# EAGLE design noise_monitor (EAGLE 9.6.2)

## Sheet 1 of 2
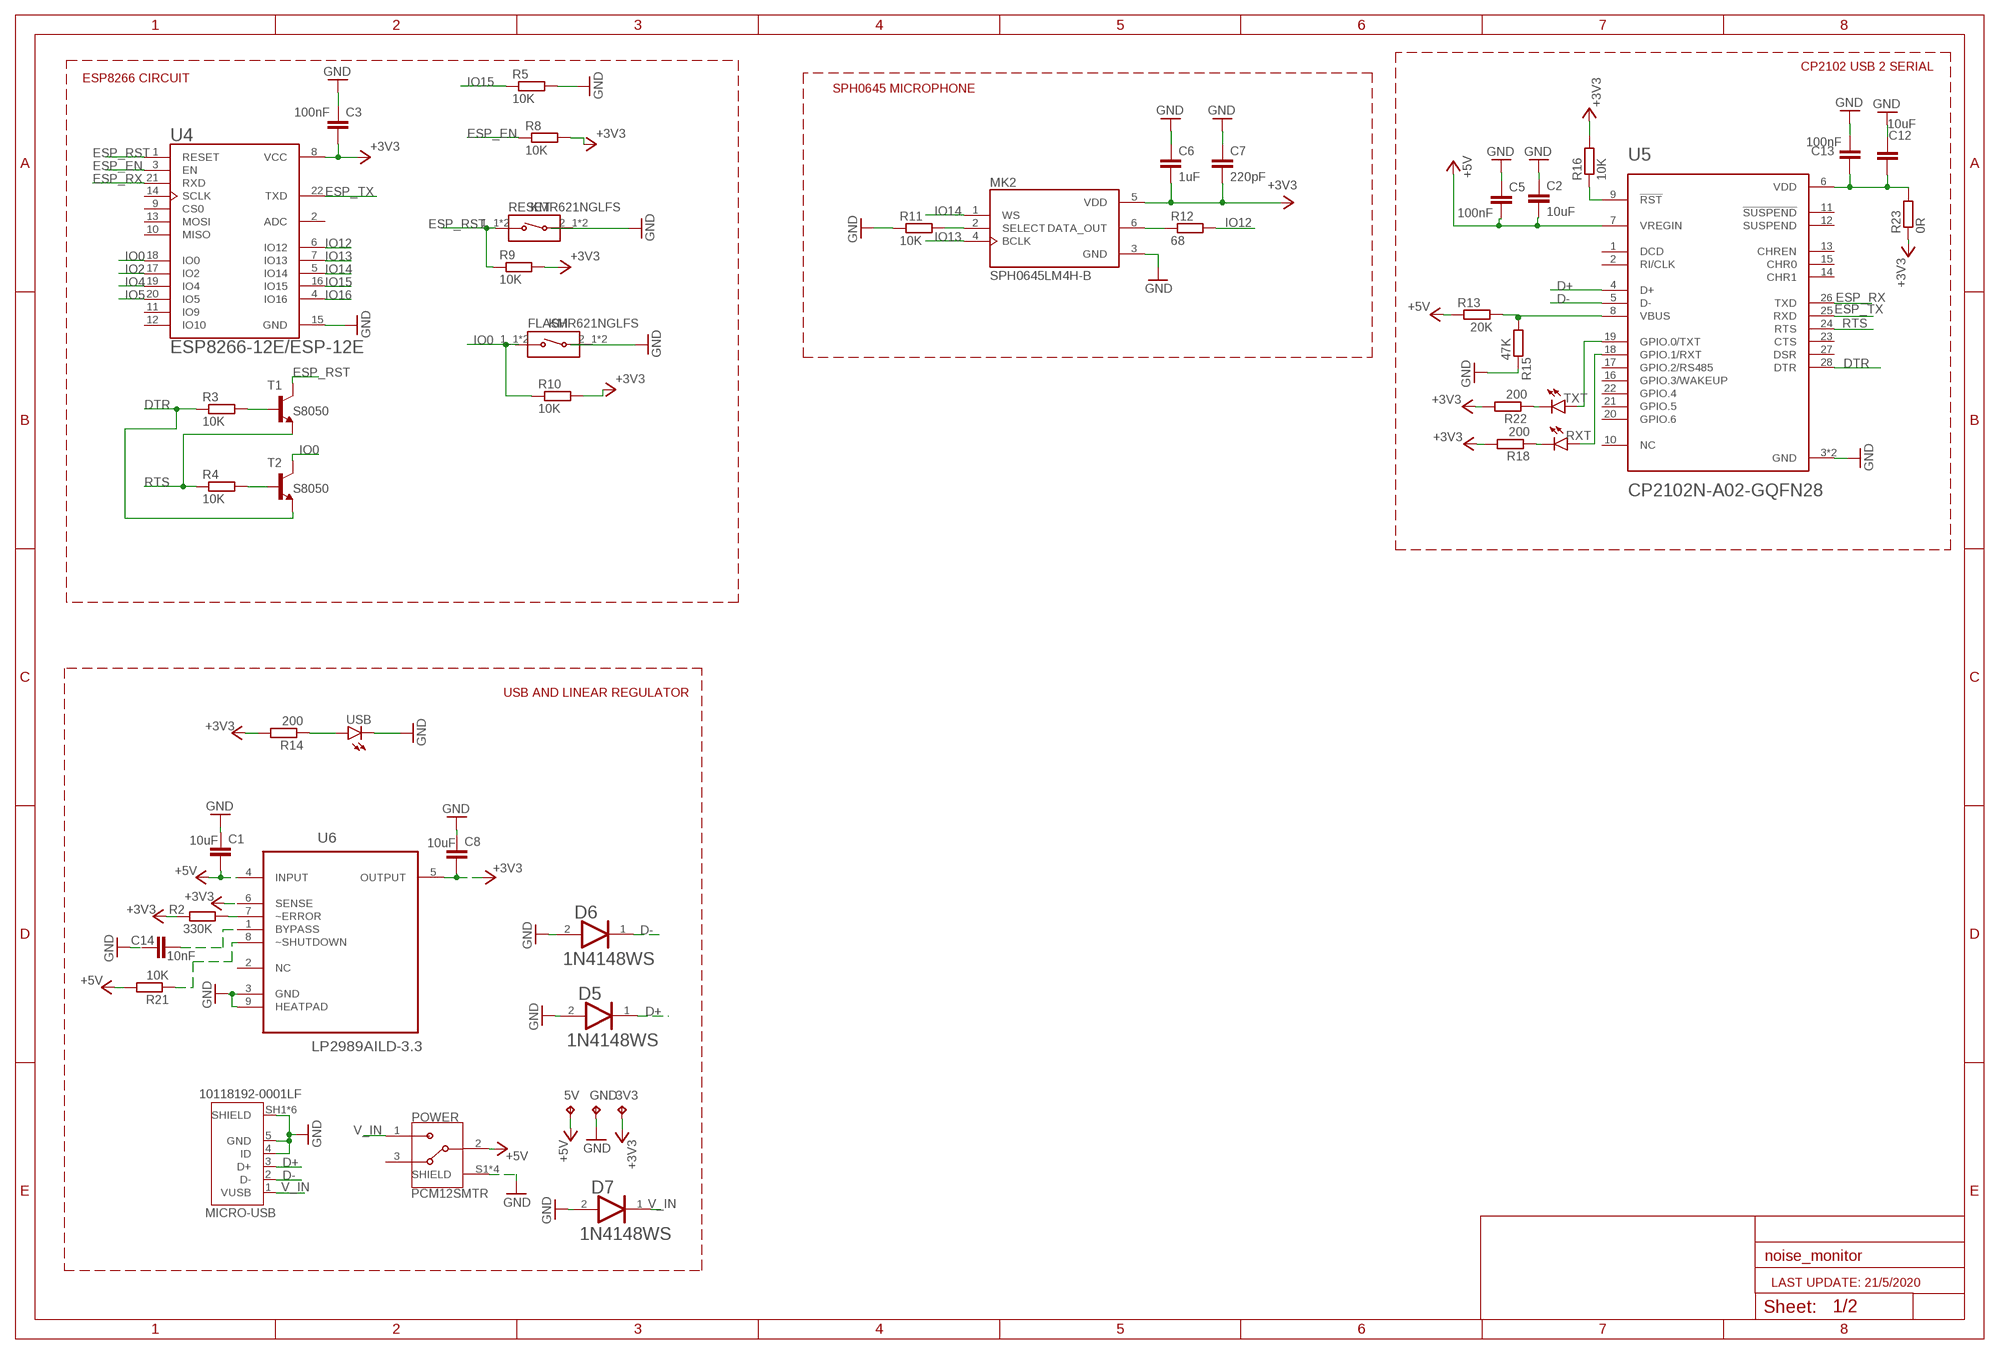
[diagram p0: schematic, sheet 1]

### Parts
3V3  TPTP06R  [TP06R]
5V  TPTP06R  [TP06R]
C1  10uF  C-EUC0603  [C0603]
C2  10uF  C-EUC0603  [C0603]
C3  100nF  C-EUC0805  [C0805]
C5  100nF  C-EUC0805  [C0805]
C6  1uF  C-EUC0603  [C0603]
C7  220pF  C-EUC0603  [C0603]
C8  10uF  C-EUC0603  [C0603]
C12  10uF  C-EUC0603  [C0603]
C13  100nF  C-EUC0805  [C0805]
C14  10nF  C-EUC0603  [C0603]
D5  ON_SEMI_1N4148WSON_SEMI_1N4148WS_0_0  [ON_SEMI_1N4148WS_0]
D6  ON_SEMI_1N4148WSON_SEMI_1N4148WS_0_0  [ON_SEMI_1N4148WS_0]
D7  ON_SEMI_1N4148WSON_SEMI_1N4148WS_0_0  [ON_SEMI_1N4148WS_0]
FLASH  KMR621NGLFS  [SW_KMR621NGLFS]
GND  TPTP06R  [TP06R]
MICRO-USB  10118192-0001LF  [AMPHENOL_10118192-0001LF]
MK2  SPH0645LM4H-B  [MIC_SPH0645LM4H-B]
POWER  PCM12SMTR  [SW_PCM12SMTR]
R2  330K  R-EU_R0603  [R0603]
R3  10K  R-EU_R0603  [R0603]
R4  10K  R-EU_R0603  [R0603]
R5  10K  R-EU_R0603  [R0603]
R8  10K  R-EU_R0603  [R0603]
R9  10K  R-EU_R0603  [R0603]
R10  10K  R-EU_R0603  [R0603]
R11  10K  R-EU_R0603  [R0603]
R12  68  R-EU_R0603  [R0603]
R13  20K  R-EU_R0603  [R0603]
R14  200  R-EU_R0603  [R0603]
R15  47K  R-EU_R0603  [R0603]
R16  10K  R-EU_R0603  [R0603]
R18  200  R-EU_R0603  [R0603]
R21  10K  R-EU_R0603  [R0603]
R22  200  R-EU_R0603  [R0603]
R23  0R  R-EU_R0201  [R0201]
RESET  KMR621NGLFS  [SW_KMR621NGLFS]
RXT  LEDCHIP-LED0603  [CHIP-LED0603]
T1  S8050  MMUN2214LT1-NPN-SC59-BEC  [SC59-BEC]
T2  S8050  MMUN2214LT1-NPN-SC59-BEC  [SC59-BEC]
TXT  LEDCHIP-LED0603  [CHIP-LED0603]
U4  ESP8266-12E/ESP-12E  [XCVR_ESP8266-12E/ESP-12E]
U5  CP2102N-A02-GQFN28  [QFN50P500X500X80-29N]
U6  LP2989AILD-3.3  [DFN400X400X80-9N]
USB  LEDCHIP-LED0603  [CHIP-LED0603]

### Nets
+3V3 [POWER]: 3V3.TP C3.2 C6.2 C7.2 C8.2 MK2.5(VDD) R2.1 R8.2 R9.2 R10.2 R14.2 R16.2 R18.2 R22.2 R23.1 U4.8(VCC) U6.5(OUTPUT) U6.6(SENSE) ; also sheet 2
+5V [POWER]: 5V.TP C1.2 C2.2 C5.2 POWER.2 R13.1 R21.2 U5.7(VREGIN) U6.4(INPUT) ; also sheet 2
D+: D5.1(CATHODE) MICRO-USB.3(D+) U5.4(D+)
D-: D6.1(CATHODE) MICRO-USB.2(D-) U5.5(D-)
DTR: R3.1 T2.E U5.28(DTR)
ESP_EN: R8.1 U4.3(EN)
ESP_RST: R9.1 RESET.1_1 RESET.1_2 T1.C U4.1(RESET)
ESP_RX: U4.21(RXD) U5.26(TXD)
ESP_TX: U4.22(TXD) U5.25(RXD)
GND: C1.1 C2.1 C3.1 C5.1 C6.1 C7.1 C8.1 C12.1 C13.1 C14.1 D5.2(ANODE) D6.2(ANODE) D7.2(ANODE) FLASH.2_1 FLASH.2_2 GND.TP MICRO-USB.4(ID) MICRO-USB.5(GND) MICRO-USB.SH1(SHIELD) MICRO-USB.SH2(SHIELD) MICRO-USB.SH3(SHIELD) MICRO-USB.SH4(SHIELD) MICRO-USB.SH5(SHIELD) MICRO-USB.SH6(SHIELD) MK2.3(GND) POWER.S1(SHIELD) POWER.S2(SHIELD) POWER.S3(SHIELD) POWER.S4(SHIELD) R5.2 R11.1 R15.2 RESET.2_1 RESET.2_2 U4.15(GND) U5.3(GND) U5.29(GND) U6.3(GND) U6.9(HEATPAD) USB.C ; also sheet 2
IO0: FLASH.1_1 FLASH.1_2 R10.1 T2.C U4.18(IO0) ; also sheet 2
IO2: U4.17(IO2) ; also sheet 2
IO4: U4.19(IO4)
IO5: U4.20(IO5)
IO12: R12.2 U4.6(IO12)
IO13: MK2.4(BCLK) U4.7(IO13)
IO14: MK2.1(WS) U4.5(IO14)
IO15: R5.1 U4.16(IO15)
IO16: U4.4(IO16)
N$1 [POWER]: C12.2 C13.2 R23.2 U5.6(VDD)
N$2: R2.2 U6.7(~ERROR)
N$3: MK2.2(SELECT) R11.2
N$4: R13.2 R15.1 U5.8(VBUS)
N$5: R16.1 U5.9(!RST)
N$7: R22.1 TXT.C
N$8: R18.1 RXT.C
N$15: R3.2 T1.B
N$16: R4.2 T2.B
N$17: TXT.A U5.19(GPIO.0/TXT)
N$18: RXT.A U5.18(GPIO.1/RXT)
N$20: C14.2 U6.1(BYPASS)
N$21: R21.1 U6.8(~SHUTDOWN)
N$22: MK2.6(DATA_OUT) R12.1
N$25: R14.1 USB.A
RTS: R4.1 T1.E U5.24(RTS)
V_IN: D7.1(CATHODE) MICRO-USB.1(VUSB) POWER.1
Unconnected: POWER.3 U4.2(ADC) U4.9(CS0) U4.10(MISO) U4.11(IO9) U4.12(IO10) U4.13(MOSI) U4.14(SCLK) U5.1(DCD) U5.2(RI/CLK) U5.10(NC) U5.11(!SUSPEND) U5.12(SUSPEND) U5.13(CHREN) U5.14(CHR1) U5.15(CHR0) U5.16(GPIO.3/WAKEUP) U5.17(GPIO.2/RS485) U5.20(GPIO.6) U5.21(GPIO.5) U5.22(GPIO.4) U5.23(CTS) U5.27(DSR) U6.2(NC)

### Notes on the sheet
- CP2102 USB 2 SERIAL
- ESP8266 CIRCUIT
- SPH0645 MICROPHONE
- USB AND LINEAR REGULATOR
- LAST UPDATE: 21/5/2020

## Sheet 2 of 2
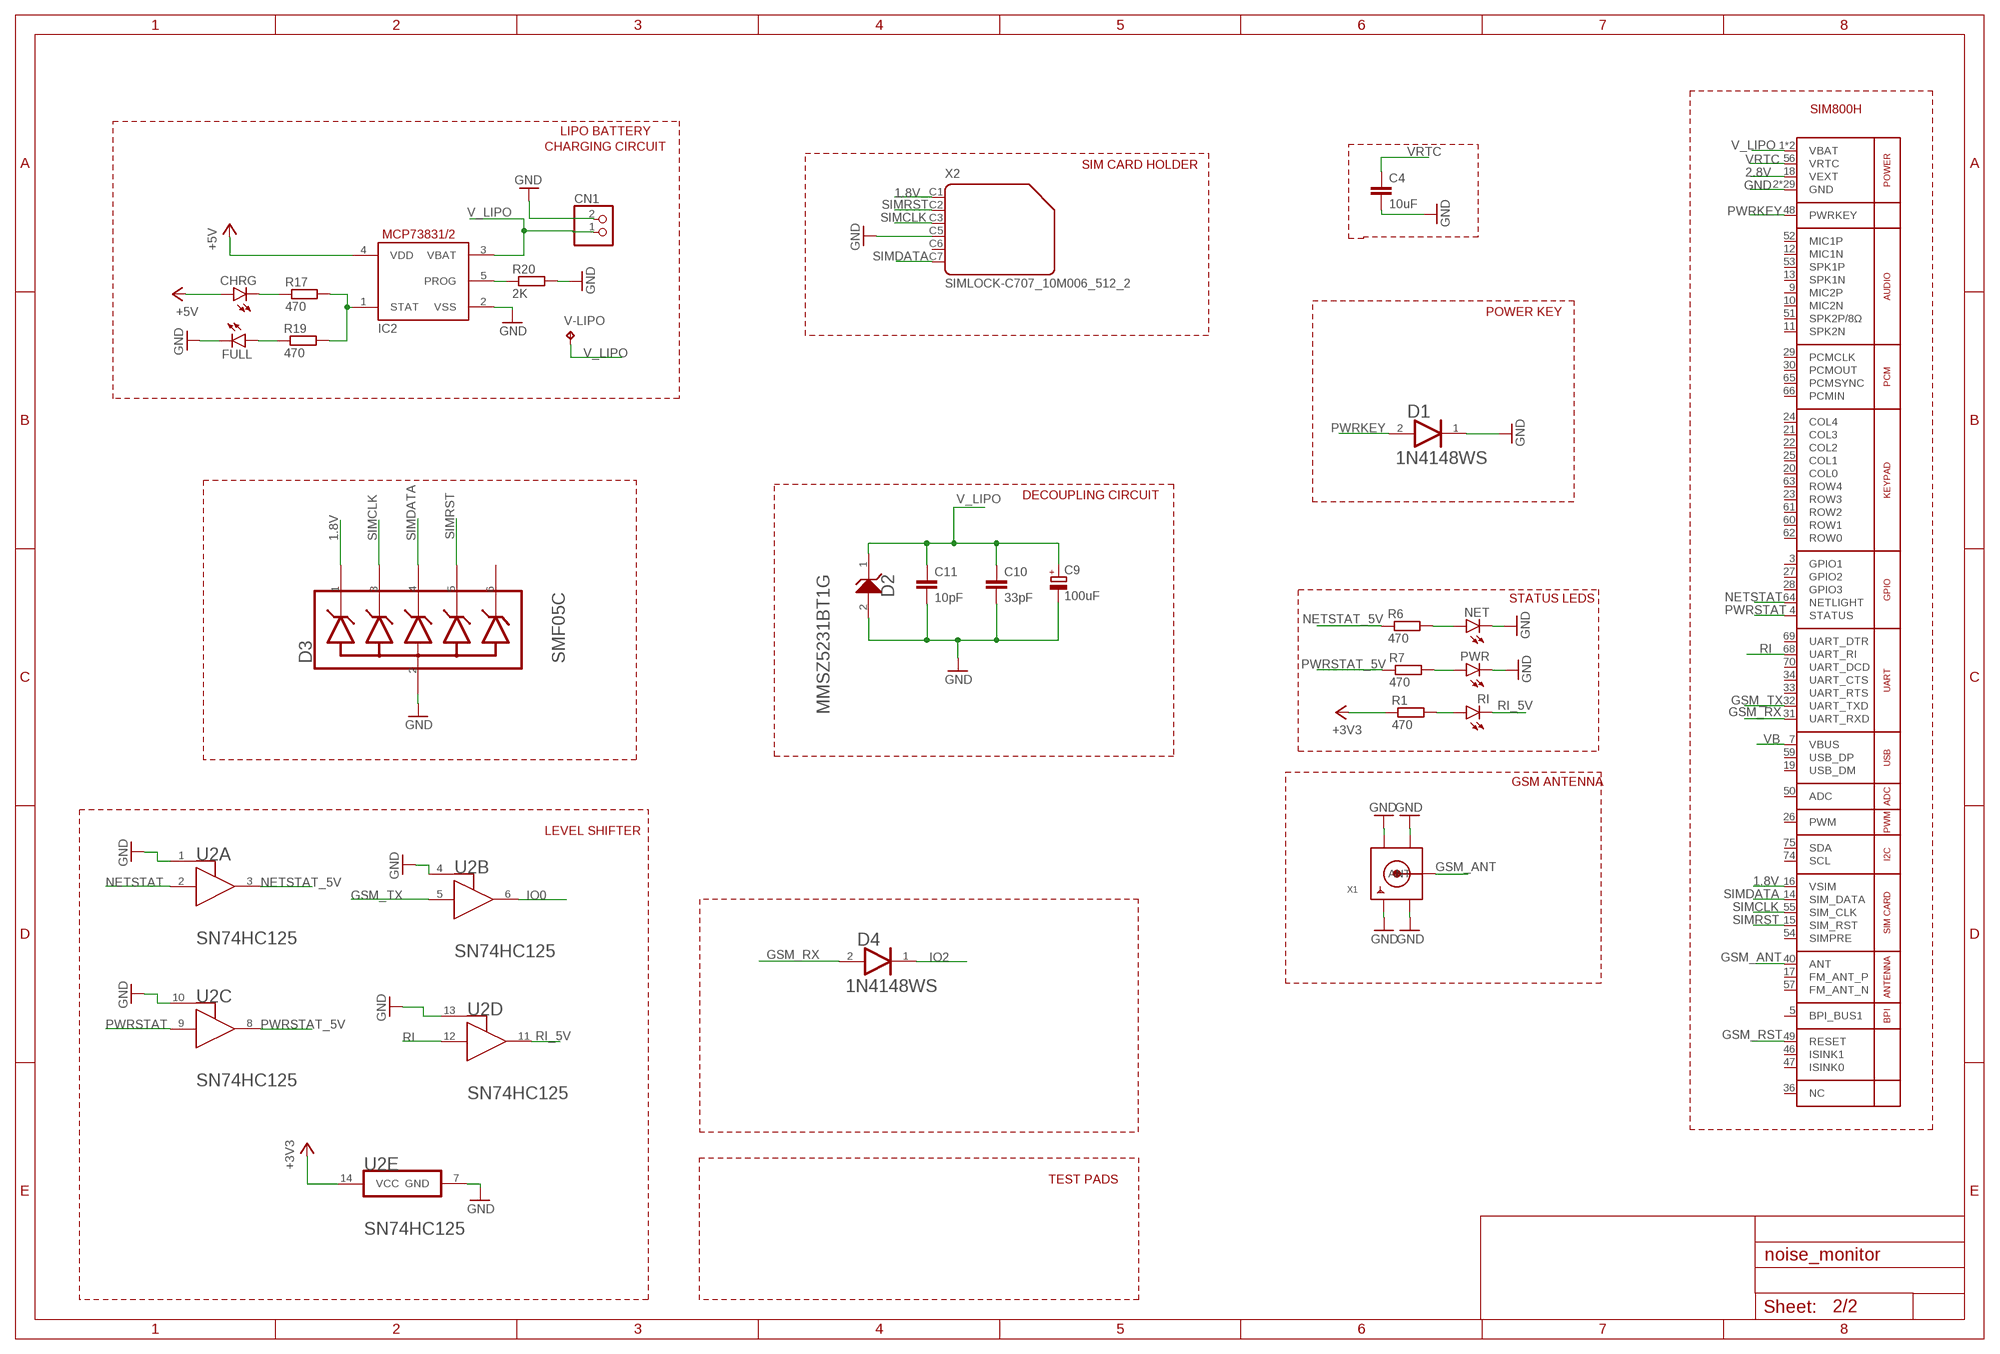
[diagram p1: schematic, sheet 2]

### Parts
C4  10uF  C-EUC0603  [C0603]
C9  100uF  CPOL-EUD  [PANASONIC_D]
C10  33pF  C-EUC0603  [C0603]
C11  10pF  C-EUC0603  [C0603]
CHRG  LEDCHIP-LED0603  [CHIP-LED0603]
CN1  JST_2PIN-SMT-RA  [JST-PH-2-SMT-RA]
D1  ON_SEMI_1N4148WSON_SEMI_1N4148WS_0_0  [ON_SEMI_1N4148WS_0]
D2  ON_SEMICONDUCTOR_MMSZ5231BT1GON_SEMICONDUCTOR_MMSZ5231BT1G_0_0  [ON_SEMICONDUCTOR_MMSZ5231BT1G_0]
D3  SEMTECH_SMF05CSEMTECH_SMF05C_0_0  [SEMTECH_SMF05C_0]
D4  ON_SEMI_1N4148WSON_SEMI_1N4148WS_0_0  [ON_SEMI_1N4148WS_0]
FULL  LEDCHIP-LED0603  [CHIP-LED0603]
IC2  MCP73831/OT  [SOT23-5L]
NET  LEDCHIP-LED0603  [CHIP-LED0603]
PWR  LEDCHIP-LED0603  [CHIP-LED0603]
R1  470  R-EU_R0603  [R0603]
R6  470  R-EU_R0603  [R0603]
R7  470  R-EU_R0603  [R0603]
R17  470  R-EU_R0603  [R0603]
R19  470  R-EU_R0603  [R0603]
R20  2K  R-EU_R0603  [R0603]
RI  LEDCHIP-LED0603  [CHIP-LED0603]
U1  GSM_SIM800L  [SIM800L]
U2  TEXAS_INSTRUMENTS_SN74HC125TEXAS_INSTRUMENTS_SN74HC125_0_0  [TEXAS_INSTRUMENTS_SN74HC125_0]
V-LIPO  TPTP06R  [TP06R]
X1  SMACONNECTOR_EDGE_UFL  [SMA_EDGELAUNCH_UFL]
X2  SIMLOCK-C707_10M006_512_2  [C707_10M006_512_2]

### Nets
1.8V: D3.1(1_CATHODE) U1.16(VSIM) X2.C1
2.8V: U1.18(VEXT)
+3V3 [POWER]: R1.1 U2.14(E:VCC) ; also sheet 1
+5V [POWER]: CHRG.A IC2.4(VDD) ; also sheet 1
GND: C4.2 C9.- C10.2 C11.2 CN1.2 D1.1(CATHODE) D2.2(A) D3.2(ANODE) FULL.C IC2.2(VSS) NET.C PWR.C R20.2 U1.2(GND) U1.6(GND) U1.8(GND) U1.35(GND) U1.37(GND) U1.38(GND) U1.39(GND) U1.41(GND) U1.43(GND) U1.44(GND) U1.45(GND) U1.58(GND) U1.67(GND) U1.71(GND) U1.72(GND) U1.73(GND) U1.76(GND) U1.77(GND) U1.78(GND) U1.79(GND) U1.80(GND) U1.81(GND) U1.82(GND) U1.83(GND) U1.84(GND) U1.85(GND) U1.86(GND) U1.87(GND) U1.88(GND) U2.1(A:1_!OE!) U2.4(B:4_!OE!) U2.7(E:GND) U2.10(C:2_!OE!) U2.13(D:3_!OE!) X1.GND@1(GND1) X1.GND@2(GND2) X1.GND@3(GND3) X1.GND@4(GND4) X2.C5 ; also sheet 1
GSM_ANT: U1.40(ANT) X1.P(ANT)
GSM_RST [BGA]: U1.49(RESET)
GSM_RX: D4.2(ANODE) U1.31(UART_RXD)
GSM_TX: U1.32(UART_TXD) U2.5(B:2A)
IO0: U2.6(B:2Y) ; also sheet 1
IO2: D4.1(CATHODE) ; also sheet 1
N$6: CHRG.C R17.1
N$9: IC2.1(STAT) R17.2 R19.2
N$10: NET.A R6.2
N$11: PWR.A R7.2
N$12: FULL.A R19.1
N$13: IC2.5(PROG) R20.1
N$14: R1.2 RI.A
NETSTAT [BGA]: U1.64(NETLIGHT) U2.2(A:1A)
NETSTAT_5V: R6.1 U2.3(A:1Y)
PWRKEY [BGA]: D1.2(ANODE) U1.48(PWRKEY)
PWRSTAT: U1.4(STATUS) U2.9(C:3A)
PWRSTAT_5V: R7.1 U2.8(C:3Y)
RI [BGA]: U1.68(UART_RI) U2.12(D:4A)
RI_5V: RI.C U2.11(D:4Y)
SIMCLK [BGA]: D3.3(2_CATHODE) U1.55(SIM_CLK) X2.C3
SIMDATA: D3.4(3_CATHODE) U1.14(SIM_DATA) X2.C7
SIMRST: D3.5(4_CATHODE) U1.15(SIM_RST) X2.C2
V_LIPO: C9.+ C10.1 C11.1 CN1.1 D2.1(K) IC2.3(VBAT) U1.1(VBAT) U1.42(VBAT) V-LIPO.TP
VB: U1.7(VBUS)
VRTC [BGA]: C4.1 U1.56(VRTC)
Unconnected: D3.6(5_CATHODE) U1.3(GPIO1) U1.5(BPI_BUS1) U1.9(MIC2P) U1.10(MIC2N) U1.11(SPK2N) U1.12(MIC1N) U1.13(SPK1N) U1.17(FM_ANT_P) U1.19(USB_DM) U1.20(COL0) U1.21(COL3) U1.22(COL2) U1.23(ROW3) U1.24(COL4) U1.25(COL1) U1.26(PWM) U1.27(GPIO2) U1.28(GPIO3) U1.29(PCMCLK) U1.30(PCMOUT) U1.33(UART_RTS) U1.34(UART_CTS) U1.36(NC) U1.46(ISINK1) U1.47(ISINK0) U1.50(ADC) U1.51(SPK2P/8Ω) U1.52(MIC1P) U1.53(SPK1P) U1.54(SIMPRE) U1.57(FM_ANT_N) U1.59(USB_DP) U1.60(ROW1) U1.61(ROW2) U1.62(ROW0) U1.63(ROW4) U1.65(PCMSYNC) U1.66(PCMIN) U1.69(UART_DTR) U1.70(UART_DCD) U1.74(SCL) U1.75(SDA) X2.C6

### Notes on the sheet
- SIM800H
- LIPO BATTERY
- CHARGING CIRCUIT
- SIM CARD HOLDER
- POWER KEY
- DECOUPLING CIRCUIT
- STATUS LEDS
- GSM ANTENNA
- LEVEL SHIFTER
- TEST PADS

## Library data of the parts
3V3 5V GND V-LIPO = testpad:TP: Test pad
C1-C8 C10-C14 = rcl:C-EU: CAPACITOR, European symbol; SPICEPREFIX: C
C9 = rcl:CPOL-EU: POLARIZED CAPACITOR, European symbol; SPICEPREFIX: C
CHRG FULL NET PWR RI RXT TXT USB = led:LED: LED OSRAM: - CHIPLED LG R971, LG N971, LY N971, LG Q971, LY Q971, LO R971, LY R971 LH N974, LH R974 LS Q976, LO Q976, LY Q976 LO Q996 - Hyper CHIPLED LW Q18S LB Q993, LB Q99A, LB R99A - SideLED LS A670, LO A670, LY A670, LG A670, LP A670 LB A673, LV A673, LT A673, LW A673 LH A674 LY A675 LS A676, LA A676, LO A676, LY A676, LW A676 LS A679, LY A679, LG A679 - Hyper Micro SIDELED® LS Y876, LA Y876, LO Y876, LY Y876 LT Y87S - SmartLED LW L88C, LW L88S LB L89C, LB L89S, LG L890 LS L89K, LO L89K, LY L89K LS L896, LA L896, LO L896, LY L896 - TOPLED LS T670, LO T670, LY T670, LG T670, LP T670 LSG T670, LSP T670, LSY T670, LOP T670, LYG T670 LG T671, LOG T671, LSG T671 LB T673, LV T673, LT T673, LW T673 LH T674 LS T676, LA T676, LO T676, LY T676, LB T676, LH T676, LSB T676, LW T676 LB T67C, LV T67C, LT T67C, LS T67K, LO T67K, LY T67K, LW E67C LS E67B, LA E67B, LO E67B, LY E67B, LB E67C, LV E67C, LT E67C LW T67C LS T679, LY T679, LG T679 LS T770, LO T770, LY T770, LG T770, LP T770 LB T773, LV T773, LT T773, LW T773 LH T774 LS E675, LA E675, LY E675, LS T675 LS T776, LA T776, LO T776, LY T776, LB T776 LHGB T686 LT T68C, LB T68C - Hyper Mini TOPLED® LB M676 - Mini TOPLED Santana® LG M470 LS M47K, LO M47K, LY M47K Source: http://www.osram.convergy.de LUXEON: - LUMILED® LXK2-PW12-R00, LXK2-PW12-S00, LXK2-PW14-U00, LXK2-PW14-V00 LXK2-PM12-R00, LXK2-PM12-S00, LXK2-PM14-U00 LXK2-PE12-Q00, LXK2-PE12-R00, LXK2-PE12-S00, LXK2-PE14-T00, LXK2-PE14-U00 LXK2-PB12-K00, LXK2-PB12-L00, LXK2-PB12-M00, LXK2-PB14-N00, LXK2-PB14-P00, LXK2-PB14-Q00 LXK2-PR12-L00, LXK2-PR12-M00, LXK2-PR14-Q00, LXK2-PR14-R00 LXK2-PD12-Q00, LXK2-PD12-R00, LXK2-PD12-S00 LXK2-PH12-R00, LXK2-PH12-S00 LXK2-PL12-P00, LXK2-PL12-Q00, LXK2-PL12-R00 Source: www.luxeon.com KINGBRIGHT: KA-3528ASYC Source: www.kingbright.com
CN1 = noise_monitor:JST_2PIN: JST 2-Pin Connectors of various flavors SMT-RA (S2B-PH-SM4) 4UConnector #17311 SMT (B2B-PH-SM4) THM-RA (S2B-PH) THM (B2B-PH)
D1 D4-D7 = noise_monitor:ON_SEMI_1N4148WS: Small Signal Diodes; CENTROID_NOT_SPECIFIED: No; DATASHEET: https://www.fairchildsemi.com/datasheets/1N/1N4148WS.pdf; DIGIKEY_DESCRIPTION: DIODE GEN PURP 75V 150MA SOD323F; DIGIKEY_PART_NUMBER: 1N4148WSFSCT-ND; IPC_LAND_PATTERN_NAME: SOD250125X70-2; LEAD_FREE: yes; MF: ON Semi; MFG_PACKAGE_IDENT: CASE 477AB; MOUSER_DESCRIPTION: Diodes - General Purpose, Power, Switching Small Signal Diode; MOUSER_PART_NUMBER: 512-1N4148WS; MPN: 1N4148WS; PACKAGE: SOD-323FL; PREFIX: D; ROHS: yes; TEMPERATURE_RANGE_HIGH: +150°C
D2 = noise_monitor:ON_SEMICONDUCTOR_MMSZ5231BT1G: ONSC-K1A2-2; CIIVA_IDS: 804101; COMPONENT_LINK_1_DESCRIPTION: Manufacturer URL; COMPONENT_LINK_1_URL: http://www.onsemi.com/; COMPONENT_LINK_3_DESCRIPTION: Package Specification; COMPONENT_LINK_3_URL: http://www.onsemi.com/pub_link/Collateral/425-04.PDF; DATASHEET: http://www.onsemi.com/pub_link/Collateral/MMSZ5221BT1-D.PDF; DATASHEET_VERSION: Rev. 12; FOOTPRINT_VARIANT_NAME_0: Manufacturer Recommended; IMPORTED: yes; IMPORTED_FROM: vault; IMPORT_TS: 1521844429; MF: On Semiconductor; MOUNTING_TECHNOLOGY: Surface Mount; MPN: MMSZ5231BT1G; PACKAGE: SOD-123-2-425-04; PACKAGE_DESCRIPTION: 2-Pin SOD, Body 1.6 x 2.69 mm; PACKAGE_VERSION: Rev. G, 10/2009; PACKING: Tape and Reel; PREFIX: D; P_MAX_W: 0.5; RELEASE_DATE: 1407150685; ROHS: No; VAULT_GUID: 27F6BF34-1EB2-4973-A1B4-1410F52D084D; VAULT_REVISION: BBBB861B-93F7-43FE-93E6-D586C34E6C45; VZ_TYP_V: 5.1
D3 = noise_monitor:SEMTECH_SMF05C: TVS Diode Array; CENTROID_NOT_SPECIFIED: No; DATASHEET: http://www.semtech.com/images/datasheet/smf05c.pdf; DIGIKEY_DESCRIPTION: DIODE TVS DIODE 5VWM 12.5VC SC70-6; DIGIKEY_PART_NUMBER: SMF05CCT-ND; JUNCTION_CAPACITANCE: 130pF max; LEAD_FREE: yes; MANUFACTURER_PRODUCT_PAGE: http://www.semtech.com/apps/product.php?pn=SMF05C; MF: Semtech; MFG_PACKAGE_IDENT: SC70-6L; MOUSER_PART_NUMBER: 947-SMF05C.TCT; MPN: SMF05C; PACKAGE: SC-70-6; PREFIX: D; REVERSE_STAND-OFF_VOLTAGE: 5V; ROHS: yes; TEMPERATURE_RANGE_HIGH: +125°C; TEMPERATURE_RANGE_LOW: -55°C
FLASH RESET = noise_monitor:KMR621NGLFS: Tactile Switches 50mA 32VDC 1.9mmH 2N IP67; AVAILABILITY: Unavailable; DESCRIPTION: Tactile Switch SPST-NO Top Actuated Surface Mount; MF: C&K; MP: KMR621NG LFS; PACKAGE: None; PRICE: None
IC2 = noise_monitor:MCP73831: MCP73831/2 Miniature Single-Cell, Fully Integrated Li-Ion, Li-Polymer Charge Management Controllers. Nice and small simple lipoly charge controller, with adjustable current and status output (LED) http://www.ladyada.net/library/pcb/eaglelibrary.html
MICRO-USB = noise_monitor:10118192-0001LF: Single Port 5 Contact Horizontal Right Angle Shielded Micro B USB 2.0 Connector; AVAILABILITY: Unavailable; DESCRIPTION: USB - micro B USB 2.0 Receptacle Connector 5 Position Surface Mount, Right Angle; MF: Amphenol ICC; MP: 10118192-0001LF; PACKAGE: None; PRICE: None
MK2 = noise_monitor:SPH0645LM4H-B: Mic Mems Digital I2s Omni -26db Check prices <https://pricing.snapeda.com/parts/SPH0645LM4H-B/Knowles/view-part?ref=eda>; AVAILABILITY: In Stock; DESCRIPTION: 20Hz ~ 10kHz Digital, I²S Microphone MEMS (Silicon) 1.62V ~ 3.6V Omnidirectional (-26dB ±3dB @ 94dB SPL) Solder Pads; MF: Knowles; MP: SPH0645LM4H-B; PACKAGE: None; PRICE: None; PURCHASE-URL: https://pricing.snapeda.com/search/part/SPH0645LM4H-B/?ref=eda
POWER = noise_monitor:PCM12SMTR: Switch Slide ON ON SPDT Side Slide 0.3A 6VDC 10000Cycles Gull Wing SMD T/R; AVAILABILITY: Unavailable; DESCRIPTION: Slide Switch SPDT Surface Mount, Right Angle; MF: C&K; MP: PCM12SMTR; PACKAGE: DO-201 C&amp;K Components; PRICE: None
R1-R23 = rcl:R-EU_: RESISTOR, European symbol; SPICEPREFIX: R
T1 T2 = noise_monitor:*-NPN-: NPN Transistror
U1 = noise_monitor:GSM_SIM800L: SIM800K Quad-Band GSM/GPRS Module 850/900/1800/1900 MHz Bluetooth EDR (3.0) FM Band: 76-109MHz (50kHz steps) -40 - 85°C
U2 = noise_monitor:TEXAS_INSTRUMENTS_SN74HC125: TI-SN74HC125-D0014A-14; BITS: 4; CIIVA_IDS: 1347642; CODE__JEDEC: MS-012; DATASHEET_VERSION: SCLS104D; FOOTPRINT_VARIANT_NAME_0: Level C; FOOTPRINT_VARIANT_NAME_1: Level B; FOOTPRINT_VARIANT_NAME_2: Level A; F__NOM_VOLTAGEMAXMHZ: 28; ICC__NOM_VOLTAGEMAXMA: 0.16; IMPORTED: yes; IMPORTED_FROM: vault; IMPORT_TS: 1521847871; INPUT_TYPE: CMOS; MF: Texas Instruments; MPN: SN74HC125; OPERATING_TEMPERATURE_RANGEC: -40 to 85; OUTPUT_TYPE: CMOS; PACKAGE: D0014A; PACKAGE_VERSION: http://www.ti.com/lit/ml/mpds177g/mpds177g.pdf; PIN_0_0_0_OUTSIDE_EDGE: dot; PIN_0_1_0_OUTSIDE_EDGE: dot; PIN_0_2_0_OUTSIDE_EDGE: dot; PIN_0_3_2_OUTSIDE_EDGE: dot; PREFIX: U; RATING: Catalog; RELEASE_DATE: 1459237643; TPD__NOM_VOLTAGEMAXNS: 26; VAULT_GUID: 3C6FD517-640E-4127-B90A-BA192E753297; VAULT_REVISION: 33E4D10A-39F8-41E5-8A10-D32CFAC933D3; VCC_MAX_V: 6; VCC_MIN_V: 2; VOLTAGE_NOM_V: 6
U4 = noise_monitor:ESP8266-12E/ESP-12E: ESP-12E WiFi Module Check prices <https://pricing.snapeda.com/parts/ESP8266-12E/ESP-12E/AI-Thinker/view-part?ref=eda>; AVAILABILITY: Not in stock; DESCRIPTION: This WiFi module has a 32-bit MCU micro and clock speeds supporting 80 MHz or 160 MHz. Supports the RTOS and integrated Wi-Fi MAC/BB/RF/PA/LNA, and has an on-board antenna.; MF: AI-Thinker; MP: ESP8266-12E/ESP-12E; PACKAGE: None; PRICE: None
U5 = noise_monitor:CP2102N-A02-GQFN28: Check availability <https://pricing.snapeda.com/parts/CP2102N-A02-GQFN28/Silicon%20Labs/view-part?ref=eda>; AVAILABILITY: In Stock; DESCRIPTION: USB Bridge, USB to UART USB 2.0 UART Interface 28-QFN (5x5); MF: Silicon Labs; MP: CP2102N-A02-GQFN28; PACKAGE: WFQFN-28 Silicon Labs; PRICE: None; PURCHASE-URL: https://pricing.snapeda.com/search/part/CP2102N-A02-GQFN28/?ref=eda
U6 = noise_monitor:LP2989AILD-3.3: Low Dropout Regulator Check availability <https://pricing.snapeda.com/parts/LP2989AILD-3.3/NOPB/Texas%20Instruments/view-part?ref=eda>; AVAILABILITY: In Stock; DESCRIPTION: 500-mA, 16-V, low-dropout voltage regulator with power good & enable; MF: Texas Instruments; MP: LP2989AILD-3.3/NOPB; PACKAGE: WSON-8 Texas Instruments; PRICE: None; PURCHASE-URL: https://pricing.snapeda.com/search/part/LP2989AILD-3.3/NOPB/?ref=eda
X1 = noise_monitor:SMACONNECTOR: SMA Connector 90° DIP SMA Connector, 50 Ohm (4UConnector: 07259)
X2 = noise_monitor:SIMLOCK-C707_10M006_512_2: C707A SIMLOCK® 2.5 mm with wide solder tails Source: Data sheet <http://www.amphenol.info/downloads/C707_10M006_512_2.pdf>; OC_FARNELL: unknown; OC_NEWARK: unknown

## Net classes
0 default: width 0.1 mm, drill 0.2 mm, clearance 0.2 mm
1 POWER: width 0.4 mm, drill 0.3 mm, clearance 0.2 mm to class 0, clearance 0.2 mm

## Board
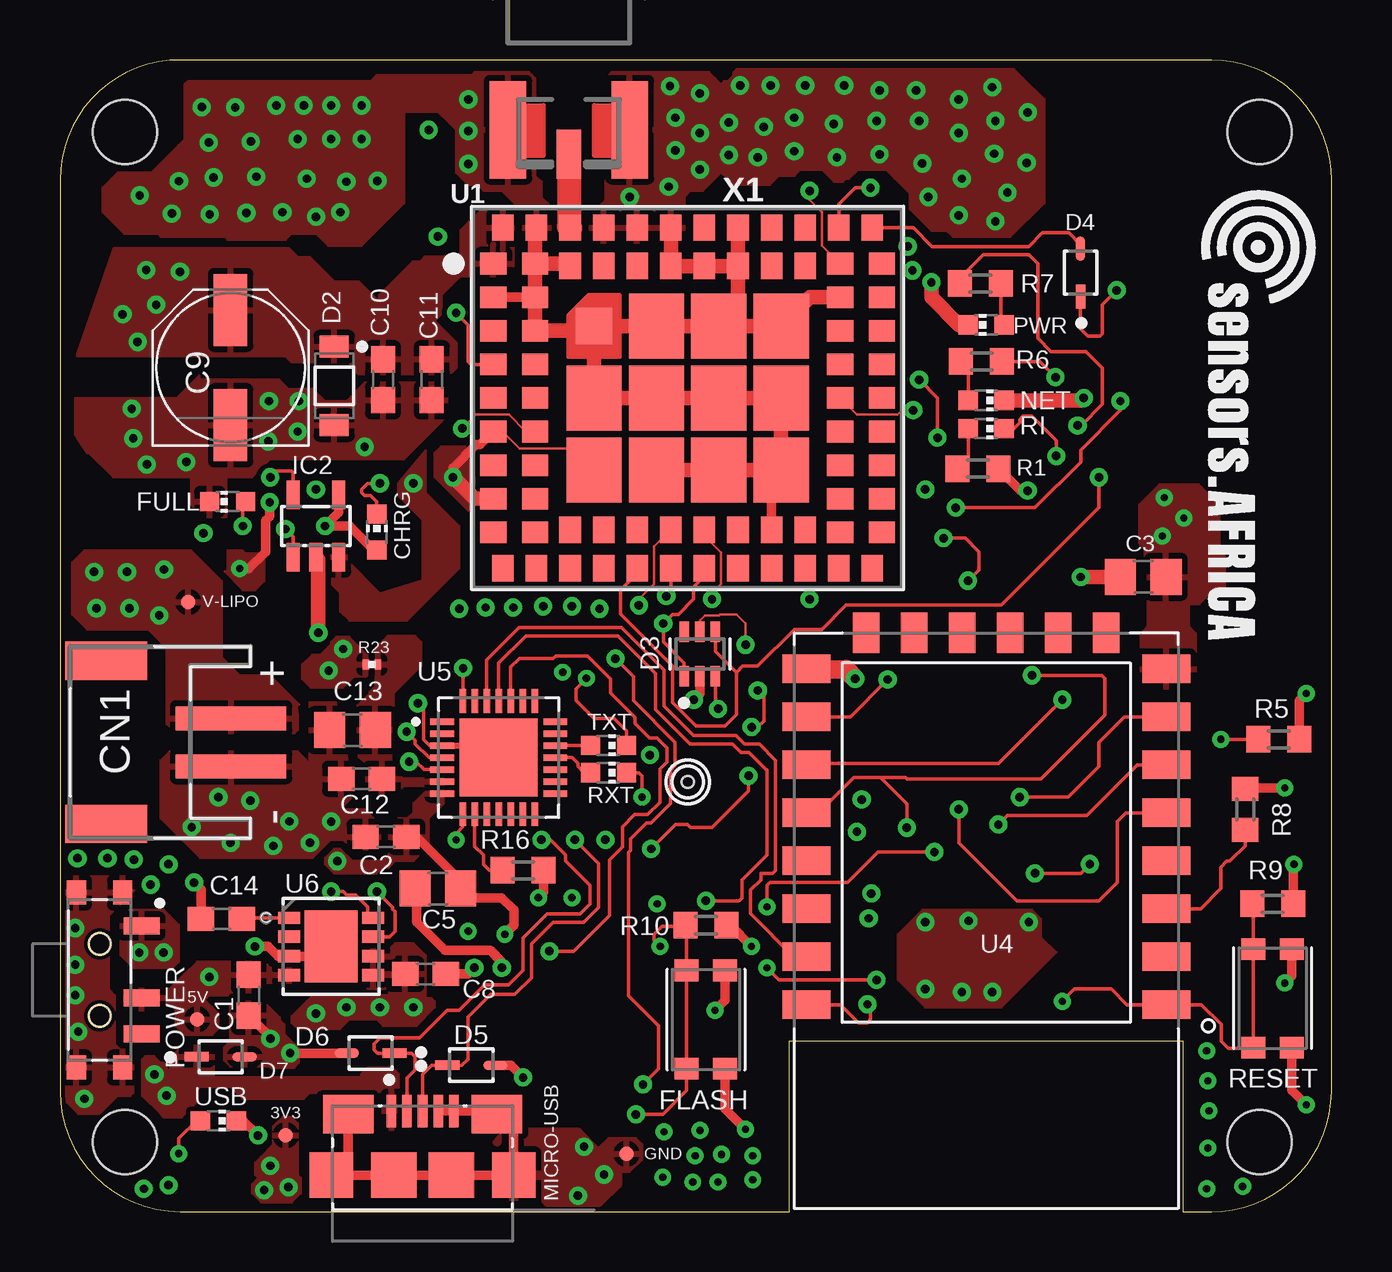
[diagram p2: board, top side]
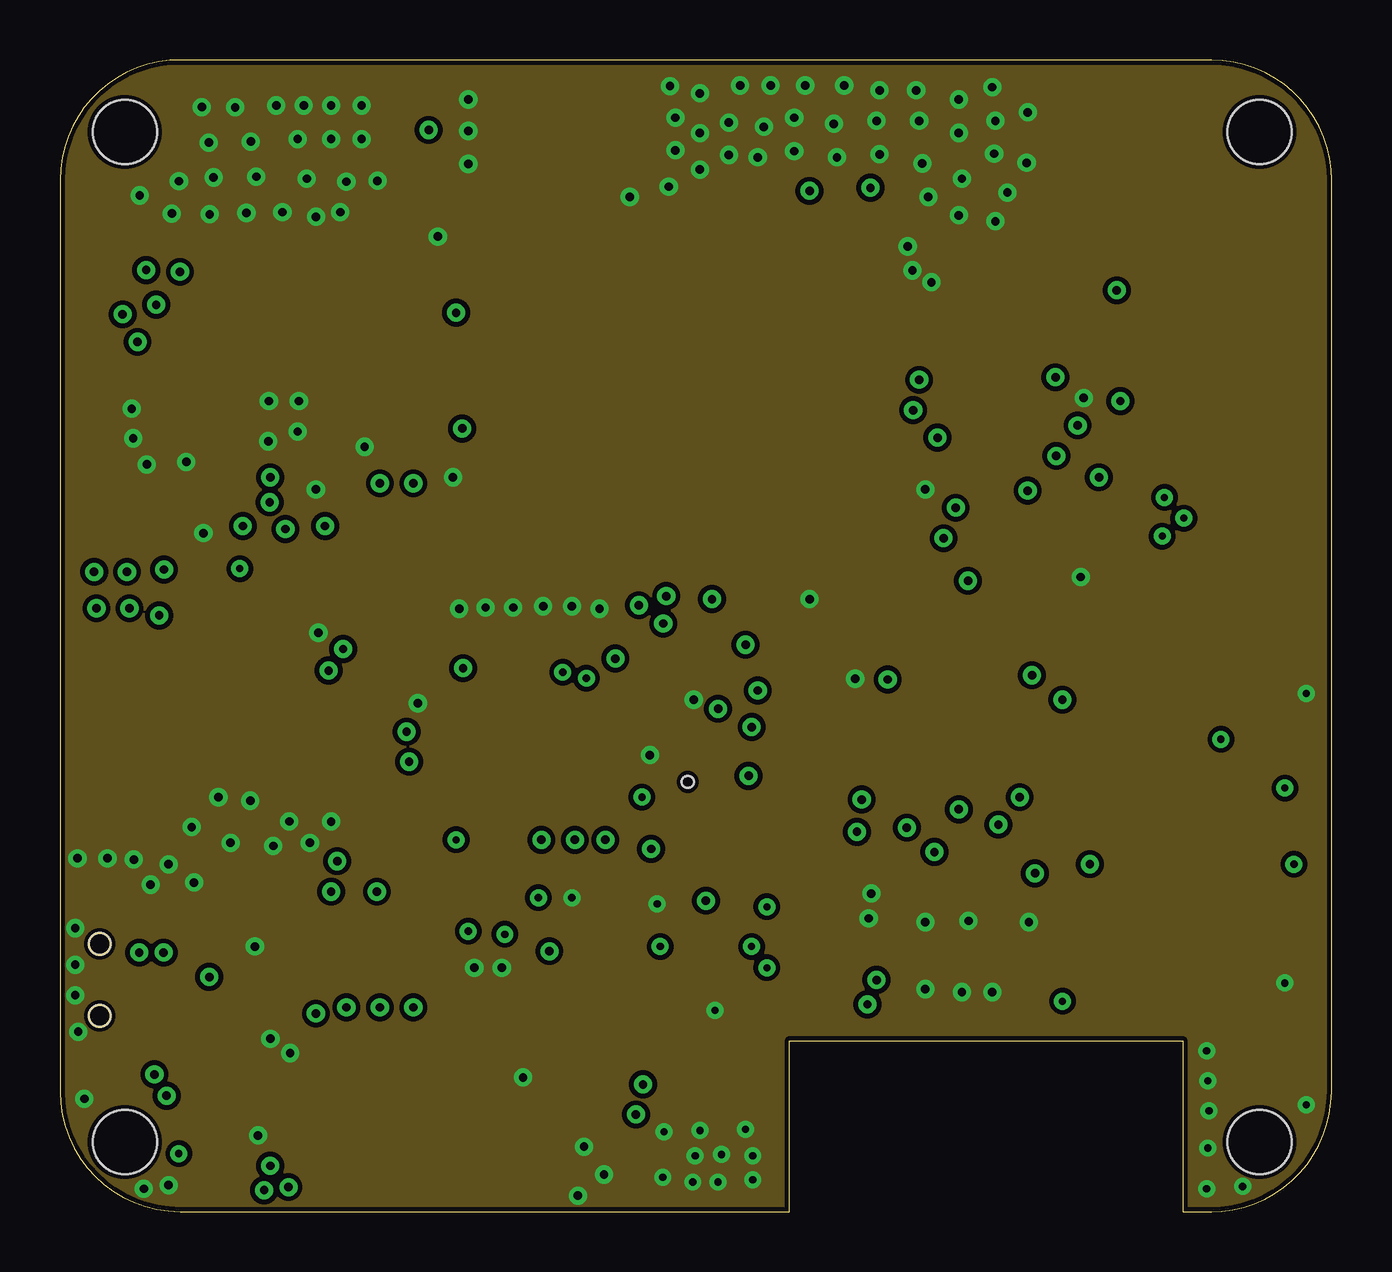
[diagram p3: board, inner layer Route2]
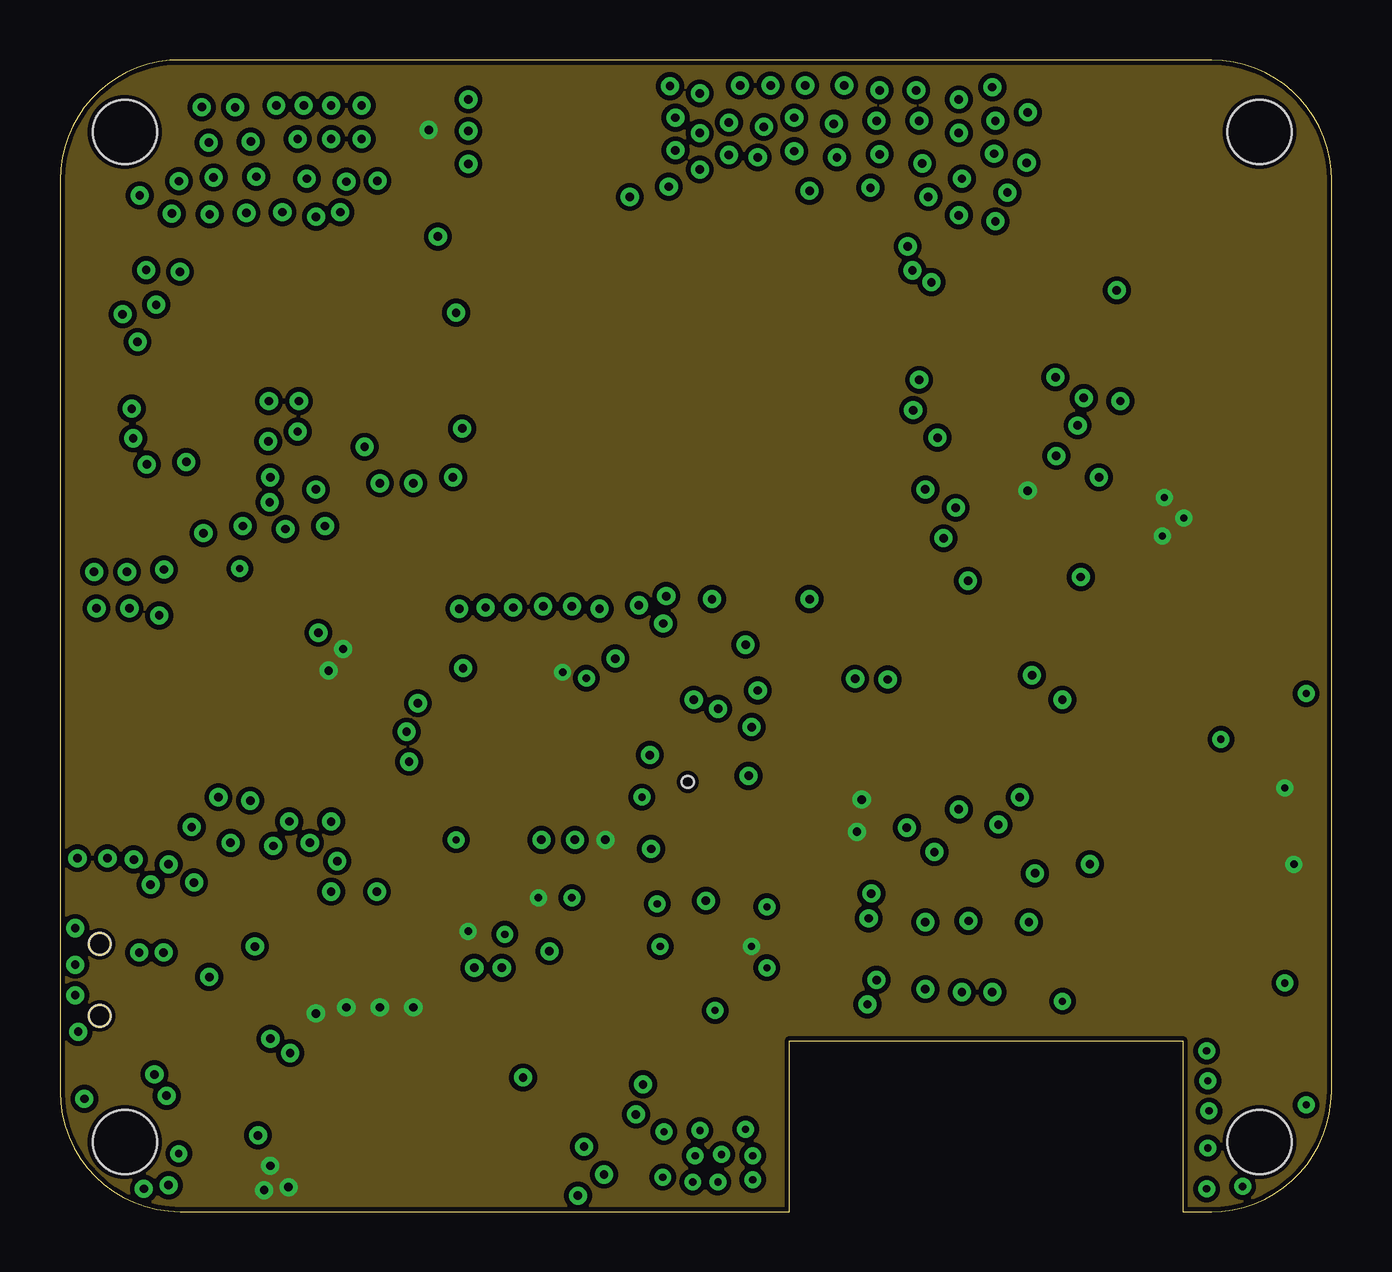
[diagram p4: board, inner layer Route15]
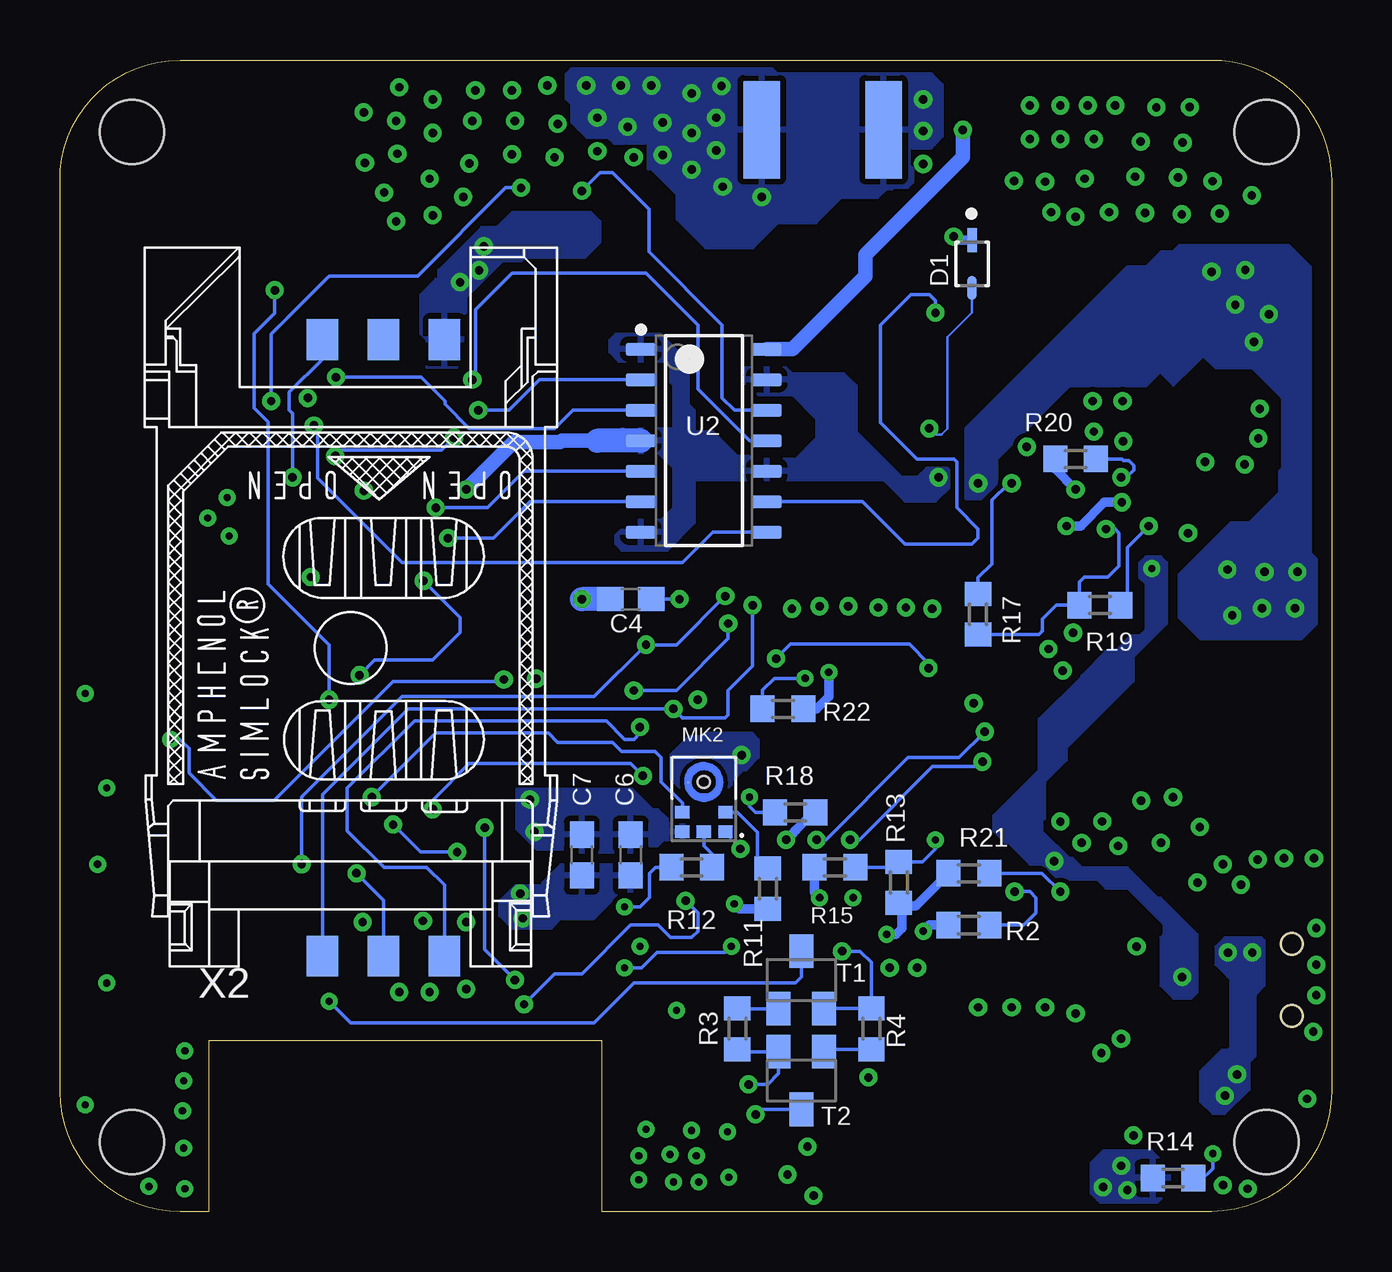
[diagram p5: board, bottom side, seen from below]

Size 53 x 48 mm. Coordinates in mm from the lower left corner, seen from the top.
Outline: 1.4,8.53 arc30 1.25,8.35 1.22,8.3 1.21,8.24 1.2,8.18 arc90 1.62,7.7 arc15 1.74,7.71 1.8,7.72 arc172 1.56,8.59 1.51,8.58 1.45,8.56 1.4,8.53
Outline: 1.62,11.6 arc173 1.62,10.7 1.68,10.7 arc173 1.68,11.6 1.62,11.6
Outline: 0,43 0,5 arc90 5,0 30.4,0 30.4,7.11 46.8,7.11 46.8,0 48,0 48.44,0.02 arc85 53,5 53,43 52.98,43.44 arc85 48,48 5,48 4.56,47.98 arc85 0,43
Copper layers (1+2*15+16): Top 0.035mm / dielectric 1.5mm / Route2 0.035mm / dielectric 0.15mm / Route15 0.035mm / dielectric 0.2mm / Bottom 0.035mm
Design rules "default *": minimum track width 0.1mm, minimum drill 0.15mm, track to track 0.1mm, track to pad 6mil, pad to pad 6mil, via to via 6mil, smd to smd 6mil, copper to edge 0.2mm, drill to drill 6mil, minimum pad ring 10mil, minimum via ring 8mil, stop-mask expansion 4mil, vias tented up to drill 0mil, thermal gap 10mil
Holes 2.67 mm at 2.7,45 2.7,2.9 50,45 50,2.9

### Footprints (pad centres in the part's own frame; a part is rotated, then mirrored left to right if it is on the bottom)
TP06R = smd 0.6 x 0.6: TP 0,0
C0603 = smd 1.1 x 1: 1 -0.85,0; 2 0.85,0
C0805 = smd 1.3 x 1.5: 1 -0.95,0; 2 0.95,0
PANASONIC_D = smd 3 x 1.4: + 2.4,0; - -2.4,0
CHIP-LED0603 = smd 0.8 x 0.8: A 0,-0.75; C 0,0.75
JST-PH-2-SMT-RA = smd 1 x 4.6: 1 1,-3.7; 2 -1,-3.7 | smd 1.6 x 3.4: NC1 -3.4,1.5; NC2 3.4,1.5
ON_SEMI_1N4148WS_0 = smd 1.006 x 0.392: 1 -1,0; 2 1,0
ON_SEMICONDUCTOR_MMSZ5231BT1G_0 = smd 0.91 x 1.22: 1 -1.635,0; 2 1.635,0
SEMTECH_SMF05C_0 = smd 0.85 x 0.4: 1 -0.925,0.65; 2 -0.925,0; 3 -0.925,-0.65; 4 0.925,-0.65; 5 0.925,0; 6 0.925,0.65
SW_KMR621NGLFS = smd 0.9 x 1: 1_1 -2.05,0.8; 1_2 2.05,0.8; 2_1 -2.05,-0.8; 2_2 2.05,-0.8
SOT23-5L = smd 0.55 x 1.2: 1 -0.95,-1.3; 2 0,-1.3; 3 0.95,-1.3; 4 0.95,1.3; 5 -0.95,1.3
AMPHENOL_10118192-0001LF = smd 0.4 x 1.35: 1 -1.3,0; 2 -0.65,0; 3 0,0; 4 0.65,0; 5 1.3,0 | smd 2.1 x 1.6: SH1 -3.1,-0.125; SH2 3.1,-0.125 | smd 1.8 x 1.9: SH3 -3.8,-2.675; SH6 3.8,-2.675 | smd 1.9 x 1.9: SH4 -1.2,-2.675; SH5 1.2,-2.675
MIC_SPH0645LM4H-B = smd 0.6 x 0.522: 1 -0.9,2.074; 2 -0.9,1.252; 4 0.9,1.252; 5 0.9,2.074; 6 0,2.074 | smd 0.1 x 0.1: 3 0.65,0.02 | hole 0.5: 0,0
SW_PCM12SMTR = smd 0.7 x 1.5: 1 -2.25,1.75; 2 0.75,1.75; 3 2.25,1.75 | smd 1 x 0.8: S1 -3.65,0.965; S2 -3.65,-0.965; S3 3.65,-0.965; S4 3.65,0.965 | hole 0.9: -1.5,0; 1.5,0
R0603 = smd 1 x 1.1: 1 -0.85,0; 2 0.85,0
R0201 = smd 0.28 x 0.43: 1 -0.255,0; 2 0.255,0
SC59-BEC = smd 1 x 1.4: B -0.95,-1.2; C 0,1.2; E 0.95,-1.2
SIM800L = smd 1.1 x 0.9: 1 -8.1,5.6; 2 -8.1,4.2; 3 -8.1,2.8; 4 -8.1,1.4; 5 -8.1,0; 6 -8.1,-1.4; 7 -8.1,-2.8; 8 -8.1,-4.2; 9 -8.1,-5.6; 22 8.1,-5.6; 23 8.1,-4.2; 24 8.1,-2.8; 25 8.1,-1.4; 26 8.1,0; 27 8.1,1.4; 28 8.1,2.8; 29 8.1,4.2; 30 8.1,5.6; 43 -6.36,5.6; 44 -6.36,4.2; 45 -6.36,2.8; 46 -6.36,1.4; 47 -6.36,0; 48 -6.36,-1.4; 49 -6.36,-2.8; 50 -6.36,-4.2; 51 -6.36,-5.6; 60 6.36,-5.6; 61 6.36,-4.2; 62 6.36,-2.8; 63 6.36,-1.4; 64 6.36,0; 65 6.36,1.4; 66 6.36,2.8; 67 6.36,4.2; 68 6.36,5.6 | smd 0.9 x 1.1: 10 -7.7,-7.1; 11 -6.3,-7.1; 12 -4.9,-7.1; 13 -3.5,-7.1; 14 -2.1,-7.1; 15 -0.7,-7.1; 16 0.7,-7.1; 17 2.1,-7.1; 18 3.5,-7.1; 19 4.9,-7.1; 20 6.3,-7.1; 21 7.7,-7.1; 31 7.7,7.1; 32 6.3,7.1; 33 4.9,7.1; 34 3.5,7.1; 35 2.1,7.1; 36 0.7,7.1; 37 -0.7,7.1; 38 -2.1,7.1; 39 -3.5,7.1; 40 -4.9,7.1; 41 -6.3,7.1; 42 -7.7,7.1; 52 -4.9,-5.5; 53 -3.5,-5.5; 54 -2.1,-5.5; 55 -0.7,-5.5; 56 0.7,-5.5; 57 2.1,-5.5; 58 3.5,-5.5; 59 4.9,-5.5; 69 4.9,5.5; 70 3.5,5.5; 71 2.1,5.5; 72 0.7,5.5; 73 -0.7,5.5; 74 -2.1,5.5; 75 -3.5,5.5; 76 -4.9,5.5 | smd 1.5 x 1.5: 77 -3.9,3 | smd 2.3 x 2.7: 78 -3.9,0; 79 -3.9,-3; 80 -1.3,-3; 81 1.3,-3; 82 3.9,-3; 83 3.9,0; 84 3.9,3; 85 1.3,3; 86 -1.3,3; 87 -1.3,0; 88 1.3,0
TEXAS_INSTRUMENTS_SN74HC125_0 = smd 1.25 x 0.55: 1 -2.625,3.81; 2 -2.625,2.54; 3 -2.625,1.27; 4 -2.625,0; 5 -2.625,-1.27; 6 -2.625,-2.54; 7 -2.625,-3.81; 8 2.625,-3.81; 9 2.625,-2.54; 10 2.625,-1.27; 11 2.625,0; 12 2.625,1.27; 13 2.625,2.54; 14 2.625,3.81
XCVR_ESP8266-12E/ESP-12E = smd 2 x 1.2: 1 -7.5,7; 2 -7.5,5; 3 -7.5,3; 4 -7.5,1; 5 -7.5,-1; 6 -7.5,-3; 7 -7.5,-5; 8 -7.5,-7; 15 7.5,-7; 16 7.5,-5; 17 7.5,-3; 18 7.5,-1; 19 7.5,1; 20 7.5,3; 21 7.5,5; 22 7.5,7 | smd 1.1 x 1.7: 9 -5,-8.5; 10 -3,-8.5; 11 -1,-8.5; 12 1,-8.5; 13 3,-8.5; 14 5,-8.5
QFN50P500X500X80-29N = smd 0.99 x 0.27: 1 -2.36,1.5; 2 -2.36,1; 3 -2.36,0.5; 4 -2.36,0; 5 -2.36,-0.5; 6 -2.36,-1; 7 -2.36,-1.5; 15 2.36,-1.5; 16 2.36,-1; 17 2.36,-0.5; 18 2.36,0; 19 2.36,0.5; 20 2.36,1; 21 2.36,1.5 | smd 0.27 x 0.99: 8 -1.5,-2.36; 9 -1,-2.36; 10 -0.5,-2.36; 11 0,-2.36; 12 0.5,-2.36; 13 1,-2.36; 14 1.5,-2.36; 22 1.5,2.36; 23 1,2.36; 24 0.5,2.36; 25 0,2.36; 26 -0.5,2.36; 27 -1,2.36; 28 -1.5,2.36 | smd 3.25 x 3.25: 29 0,0
DFN400X400X80-9N = smd 0.914 x 0.508: 1 -1.753,1.194; 2 -1.753,0.406; 3 -1.753,-0.406; 4 -1.753,-1.194; 5 1.753,-1.194; 6 1.753,-0.406; 7 1.753,0.406; 8 1.753,1.194 | smd 2.21 x 2.997: 9 0,0
SMA_EDGELAUNCH_UFL = smd 4.064 x 1.524: GND@1 2.032,-2.54; GND@2 2.032,2.54 | smd 4.064 x 1.524 bottom: GND@3 2.032,2.54; GND@4 2.032,-2.54 | smd 2.032 x 1.016: P 3.048,0
C707_10M006_512_2 = smd 1.7 x 1.3: C1 -12.85,-3.915; C2 -12.85,-1.375; C3 -12.85,1.165; C5 12.85,-3.915; C6 12.85,-1.375; C7 12.85,1.165

### Placement (x,y rotation side)
3V3  9.4,3.17 0 top
5V  5.71,8 0 top
C1  7.87,9.02 90 top
C2  13.59,15.62 0 top
C3  45.15,26.45 0 top
C4  29.21,25.53 180 bottom
C5  15.75,13.46 0 top
C6  29.21,14.86 90 bottom
C7  31.24,14.86 90 bottom
C8  15.24,9.91 180 top
C9  7.11,35.18 90 top
C10  13.46,34.67 270 top
C11  15.49,34.67 270 top
C12  12.57,18.03 0 top
C13  12.19,20.07 0 top
C14  6.73,12.19 0 top
CHRG  13.21,28.32 0 top
CN1  3.43,19.56 90 top
D1  14.99,39.5 270 bottom
D2  11.43,34.42 270 top
D3  26.67,23.24 90 top
D4  42.54,39.14 90 top
D5  17.14,6.1 0 top
D6  12.95,6.6 180 top
D7  6.7,6.45 0 top
FLASH  26.92,8 90 top
FULL  6.99,29.59 90 top
GND  23.62,2.41 0 top
IC2  10.67,28.57 0 top
MICRO-USB  15.11,4.19 0 top
MK2  26.16,17.91 180 bottom
NET  38.61,33.81 270 top
POWER  1.65,9.65 270 top
PWR  38.61,36.96 90 top
R1  38.26,30.96 180 top
R2  15.11,11.94 0 bottom
R3  24.77,7.62 90 bottom
R4  19.18,7.62 270 bottom
R5  50.8,19.68 0 top
R6  38.41,35.43 180 top
R7  38.36,38.68 0 top
R8  49.4,16.76 90 top
R9  50.55,12.83 0 top
R10  26.92,11.94 0 top
R11  23.5,13.46 90 bottom
R12  26.67,14.35 180 bottom
R13  18.03,13.72 90 bottom
R14  6.6,1.4 180 bottom
R15  20.7,14.35 180 bottom
R16  19.3,14.22 0 top
R17  14.73,24.89 270 bottom
R18  22.35,16.64 0 bottom
R19  9.65,25.27 180 bottom
R20  10.67,31.37 180 bottom
R21  15.11,14.1 180 bottom
R22  22.86,20.95 0 bottom
R23  13,22.8 0 top
RESET  50.55,8.89 90 top
RI  38.61,32.64 270 top
RXT  22.86,18.29 270 top
T1  22.1,9.65 0 bottom
T2  22.1,5.46 180 bottom
TXT  22.86,19.43 270 top
U1  26.16,33.91 0 top
U2  26.16,32.13 0 bottom
U4  38.61,15.62 180 top
U5  18.29,18.92 0 top
U6  11.3,11.05 0 top
USB  6.61,3.79 270 top
V-LIPO  5.33,25.4 0 top
X1  21.21,47.12 270 top
X2  40.89,23.5 90 bottom

### Tracks (layer width: path | path; a pad name or v marks a point on that pad's centre or on a via)
1.8V  (via drill 0.35)
  Top 0.15: U1.16 26.86,26.48 26.42,26.04 26.42,25.53 25.78,24.89 25.53,24.89 v25.15,24.51 25.15,23.75 26.02,22.88 D3.1 | v29.08,21.72 29.34,21.46 29.34,20.45 29.08,20.19 v28.83,20.19
  Bottom 0.15: v25.15,24.51 25.15,23.88 27.3,21.72 v29.08,21.72 | v28.83,20.19 28.83,19.94 29.08,19.68 29.46,19.68 30.23,20.45 38.23,20.45 41.02,17.65 41.02,15.88 39.5,14.35 37.72,14.35 36.98,13.61 X2.C1
+3V3  (via drill 0.3, 0.35)
  Top 0.4: v40.34,30.05 40.03,30.05 R1.1 | R10.2 27.94,11.94 v28.83,11.05 | R9.2 51.4,14.44 v51.44,14.48 | R8.2 49.44,17.65 v51.05,17.65 | R16.2 20.15,13.3 v19.94,13.08
  Bottom 0.4: R2.1 16.76,11.94 v17.02,11.68 | R22.2 21.46,20.95 20.95,21.46 v20.95,22.48 | R18.2 21.59,16.64 22.3,15.93 22.3,15.92 22.54,15.69 v22.73,15.49
  Bottom 0.6: U2.14 22.48,35.94 19.43,38.99 19.43,39.88 15.37,43.94 v15.37,45.09
  other vias: 14.73,8.51 13.34,8.51 11.94,8.51 10.67,8.26 8.76,1.91 9.53,1.02 8.51,0.89 11.2,22.55 45.94,28.15 46.03,29.76 33.22,15.82 33.42,17.18 11.8,23.45 46.84,28.9
  pour Bottom: 28.32,15.49 28.32,16.76 29.16,17.6 33.94,17.6 33.94,15.94 33.11,15.11 31.88,15.11 31.75,14.99 28.83,14.99
  pour Bottom: 26.8,16.13 27.56,16.13 27.69,16.26 27.69,16.38 28.07,16.76 28.32,16.76 28.7,16.38 28.7,15.37 28.57,15.24 28.07,15.24 27.81,15.49 26.8,15.49
  pour Route15: 0,0 52.83,0 52.83,47.88 0.13,47.88 0,47.88
  pour Top: 12.57,10.03 12.57,9.53 12.83,9.27 14.22,9.27 14.86,9.27 14.99,9.4 14.99,10.54 14.61,10.92 12.83,10.92 12.7,10.92 12.57,10.79
  pour Top: 13.72,10.41 13.72,9.02 13.46,8.76 13.46,8.64 13.46,8 13.59,7.87 14.48,7.87 14.73,7.87 15.24,8.38 15.24,10.67 14.73,11.18 14.48,11.18 13.97,11.18 13.84,11.05 13.72,10.92
  pour Top: 13.84,8.89 13.72,9.02 12.06,9.02 10.54,9.02 10.29,8.76 9.65,8.13 9.65,7.87 9.91,7.62 11.05,7.62 11.68,7.62 12.06,8 13.21,8 13.46,7.75 14.86,7.75 15.62,8.51 15.62,8.76 15.49,8.89
  pour Bottom: 6.86,1.91 6.73,1.78 6.73,1.02 6.73,0.89 7.11,0.51 7.24,0.38 8.51,0.38 9.65,0.38 9.78,0.51 10.03,0.76 10.03,1.91 10.03,2.03 9.53,2.54 8.13,2.54 7.49,2.54
  pour Top: 8.38,2.29 8.13,2.03 8.13,1.52 8.26,1.4 8,1.14 8,0.76 8.38,0.38 8.51,0.38 9.65,0.38 10.03,0.76 10.03,1.27 10.03,1.4 9.91,1.52 9.91,3.3 9.91,3.68 9.65,3.94 9.27,3.94 9.02,3.68 8.89,3.56 8.89,2.79
  pour Top: 10.1,22.2 10.45,21.85 11.8,21.85 12.25,22.3 12.75,22.3 12.8,22.35 12.8,23.2 12.05,23.95 11.5,23.95 11.3,23.75 11.3,23.65 10.85,23.2 10.5,23.2 10.1,22.8
  pour Top: 45.05,23.2 45.05,21.95 45.15,21.85 45.2,21.8 47.15,21.8 47.35,22 47.35,23.25 47.35,24.1 47.05,24.4 47.05,25.3 46.9,25.45 46.9,25.65 48.35,25.65 48.55,25.85 48.55,27.3 48.4,27.45 48,27.85 45.65,27.85 45.35,27.55 45.35,27.2 45.35,24.4 45.25,24.3 45.05,24.1
  pour Top: 45.34,27.09 45.34,25.74 45.52,25.56 45.76,25.32 46.87,25.32 47.49,25.32 47.97,25.8 48.33,26.16 48.33,28.48 48.33,29.44 47.6,30.17 47.46,30.31 45.83,30.31 44.98,29.46 44.98,29.34 44.98,27.86 45.05,27.79 45.19,27.65 45.19,27.63 45.22,27.6 45.22,27.32 45.34,27.2
+5V  (via drill 0.3, 0.35)
  Top 0.4: v8.74,29.56 8.74,28.98 8.57,28.8 8.57,27.49 7.87,26.8 v7.49,26.8 | IC2.4 11.62,29.14 v11.05,28.57 12.06,28.57 13.07,27.57 CHRG.A | 14.36,15.62 C2.2 14.86,15.62 16.7,13.78 C5.2 17.08,13.08 18.41,13.08 18.92,12.57 18.92,11.94 v18.54,11.56
  Bottom 0.4: v8.74,29.56 9.46,29.56 10.45,28.57 v11.05,28.57 | v18.54,11.56 18.16,11.56 17.91,11.81 17.91,12.74 | 17.91,12.74 R13.1 | R21.2 17.32,12.74 17.91,12.74
  other vias: 6.22,9.78 11.56,14.61
  pour Top: 2.67,9.27 2.67,8.51 2.79,8.38 4.06,8.38 4.32,8.64 5.08,8.64 5.33,8.89 6.1,8.89 6.22,9.02 6.99,9.02 7.11,9.14 8.26,9.14 8.64,9.53 9.91,9.53 10.03,9.65 10.03,10.16 9.14,10.16 8.76,10.16 8.64,10.29 8.51,10.29 8.38,10.41 6.48,10.41 5.71,10.41 5.21,9.91 4.57,9.27 4.19,9.27
  pour Bottom: 5.59,11.56 5.59,9.14 5.84,8.89 6.6,8.89 7.11,9.4 7.11,11.43 6.99,11.56 6.99,11.94 8.51,13.46 9.4,13.46 9.78,13.84 11.43,13.84 12.06,14.48 12.57,14.48 13.46,15.37 13.59,15.37 14.1,15.88 14.1,16.51 13.72,16.89 12.7,16.89 12.06,16.26 12.06,15.88 10.92,14.73 10.79,14.73 10.41,14.35 8.51,14.35 7.24,13.08 7.11,13.08
  pour Bottom: 11.94,16.38 12.19,16.13 13.46,16.13 13.72,16.38 13.72,16.89 12.19,18.41 12.19,20.53 10.39,22.33 10.43,22.33 9.4,23.37 9.02,23.37 8.38,24 8,24 7.75,24.26 7.75,26.16 8,26.42 8,27.05 7.75,27.3 7.11,27.3 6.86,27.05 6.86,24.51 8.26,23.11 8.26,22.1 11.05,19.3 11.05,18.8 11.94,17.91
  pour Top: 6.99,27.56 7.62,27.56 7.75,27.43 8.26,27.43 8.51,27.18 8.51,26.29 8.13,25.91 7.62,25.91 6.86,26.67 6.99,26.67
  pour Top: 4.95,8.89 4.83,8.76 4.83,7.75 5.21,7.37 5.33,7.37 6.35,7.37 6.6,7.62 6.6,7.75 6.6,8.26 6.35,8.51 5.84,9.02 5.08,9.02
  pour Top: 11.68,15.11 11.43,15.11 11.05,14.73 11.05,14.48 11.43,14.1 13.21,14.1 13.46,14.35 13.72,14.35 13.97,14.61 14.73,14.61 15.37,15.24 15.37,16.38 16.13,17.14 16.51,17.14 16.51,17.53 16.45,17.58 15.3,17.58 14.73,17.02 14.73,16.64 14.48,16.38 14.1,16.38 13.97,16.26 13.84,16.26 13.72,16.13 13.72,14.86 13.46,14.61 12.19,14.61
D+  (via drill 0.35)
  Top 0.15: v21.46,15.49 22.45,14.51 22.45,12.67 21.84,12.06 21.83,12.06 21.82,12.05 20.55,12.05 19.65,11.15 19.65,9.75 18.95,9.05 17.94,9.05 17,8.11 17,6.35 16.75,6.1 D5.1 15.5,6.1 15.11,5.71 MICRO-USB.3 | v14.45,20 14.81,19.64 14.81,19.49 15.38,18.92 U5.4
  Bottom 0.15: v21.46,15.49 21.08,15.49 17.65,18.92 15.53,18.92 v14.45,20
D-  (via drill 0.35)
  Top 0.15: v20.07,15.49 20.45,15.49 21.08,14.86 21.08,14.61 22.1,13.59 22.1,12.83 21.67,12.4 20.3,12.4 19.3,11.4 19.3,10.04 18.71,9.45 17.71,9.45 16.64,8.38 16.13,8.38 14.99,7.24 13.34,7.24 13.1,7 13.1,6.75 13.25,6.6 D6.1 13.95,6.55 14,6.6 14.65,6.6 14.8,6.45 14.8,5.9 14.46,5.56 MICRO-USB.2 | v14.55,18.75 14.85,18.75 15.18,18.42 U5.5
  Bottom 0.15: v20.07,15.49 19.68,15.49 16.64,18.54 14.76,18.54 v14.55,18.75
DTR  (via drill 0.35)
  Top 0.15: v24.3,5.3 24.95,5.95 24.95,7.75 23.7,9 23.7,14.97 23.79,15.06 23.79,15.54 24.45,16.2 24.64,16.2 25.45,17 25.45,18.39 25.64,18.59 25.64,19.55 23.9,21.3 23.9,22.3 v23.15,23.05 | v16.8,22.65 16.8,21.3 U5.28
  Bottom 0.15: R3.1 24.66,6.66 T2.E 23.05,5.75 23.5,5.3 v24.3,5.3 | v23.15,23.05 22.55,23.65 17.6,23.65 16.8,22.85 v16.8,22.65
ESP_EN
  Top 0.15: R8.1 49.4,15.24 48.77,14.61 48.64,14.61 48.39,14.35 48.39,13.46 47.55,12.62 U4.3
ESP_RST  (via drill 0.3)
  Top 0.15: R9.1 49.75,12.78 RESET.1_2 RESET.1_1 49.71,6.8 48.7,6.8 48.4,7.1 48.4,7.8 47.58,8.62 U4.1 44.47,8.62 43.81,9.27 42.29,9.27 v41.78,8.76
  Bottom 0.15: v41.78,8.76 40.89,7.87 30.73,7.87 29.08,9.53 22.35,9.53 22.1,9.78 T1.C
ESP_RX
  Top 0.15: U5.26 17.79,23 19.14,24.35 23.4,24.35 25.18,22.57 25.18,21.08 26.41,19.85 28.17,19.85 28.54,19.49 29.16,19.49 29.83,18.81 29.83,14.22 29.71,14.1 29.21,14.1 29.21,13.83 28.78,13.4 28.78,12.42 30.58,10.62 U4.21
ESP_TX  (via drill 0.35)
  Top 0.15: U5.25 18.29,22.86 19.43,24 23.25,24 24.83,22.43 24.83,20.93 26.26,19.5 28.03,19.5 28.39,19.14 28.73,19.14 29.45,18.41 29.46,18.41 29.46,14.86 28.43,13.83 28.43,13.08 28.3,12.95 v26.92,12.95 | v33.66,8.64 33.78,8.51 33.78,8 33.66,7.87 33.27,7.87 32.53,8.62 U4.22
  Bottom 0.15: v26.92,12.95 26.42,12.45 26.42,11.68 26.67,11.43 27.56,11.43 28.07,11.94 29.21,11.94 31.24,9.91 32.38,9.91 v33.66,8.64
GND  (via drill 0.3, 0.35)
  Top 0.1: U1.6 18.45,32.51 19.15,31.81 21.36,31.81 U1.79
  Top 0.15: U5.3 15.41,19.42 15.16,19.67 15.16,20.95 v14.92,21.19 | 17.3,19.4 17.78,18.92 U5.29
  Top 0.25: U5.3 17.28,19.42
  Top 0.4: U1.6 17.51,31.96 17.35,31.96 16.38,31 v16.38,30.61 | U1.58 29.66,30.85 29.72,30.91 | U1.2 U1.44 | D3.2 26.67,21.59 v26.42,21.34 | v8.77,7.2 8.77,7.27 C1.1 | C14.1 5.88,13.42 v5.59,13.72 | USB.C 7.64,3.79 v8.26,3.17 | D6.2 v9.59,6.6 | D5.2 18.8,6.1 v19.3,5.59 | MICRO-USB.SH1 12.01,2.22 MICRO-USB.SH3 MICRO-USB.SH4 MICRO-USB.SH5 MICRO-USB.SH6 18.91,3.37 MICRO-USB.SH2 18.09,4.19 MICRO-USB.5 MICRO-USB.4 | v8.13,11.05 8.68,11.05 9.09,10.64 U6.3 10.9,10.64 U6.9 | C8.1 17.02,9.91 v17.27,10.16 | C5.1 14.86,13.4 14.86,12.06 16.05,10.88 17.95,10.88 18.41,10.41 v18.41,10.16 | FLASH.2_2 27.72,8.8 v27.3,8.38 | FLASH.2_1 27.72,4.28 v28.57,3.43 | R5.2 51.65,21.3 v51.94,21.59 | RESET.2_2 51.35,9.82 v51.05,9.53 | RESET.2_1 51.35,5.04 v51.94,4.45 | 17.28,19.42 17.3,19.4
  Top 0.6: NET.C 42.57,33.81 v42.67,33.91 | PWR.C 37.48,36.96 36.32,38.11 v36.32,38.73 | IC2.2 10.77,27.18 v10.77,24.13 | U1.80 U1.81 29.72,30.91 U1.82 U1.83 U1.88 U1.87 U1.78 U1.77 | U1.77 U1.86 U1.85 | U1.85 U1.84 31.26,38.11 U1.67 | U1.85 28.26,37.71 U1.71 | U1.71 U1.72 U1.73 U1.37 | U1.71 U1.35 | U1.77 22.06,36.71 U1.45 U1.44 U1.43 | U1.43 21.16,39.51 U1.76 | U1.43 19.8,40.95 U1.41 | U1.8 17.28,29.71 v16.38,30.61 | C3.1 v42.55,26.45
  Top 0.8: U4.15 32.78,22.6 v33.15,22.21
  Bottom 0.4: D1.1 15.61,40.5 v15.75,40.64 | R20.2 11.52,30.95 v10.67,30.1 | R11.1 24.68,12.61 v24.89,12.83 | R15.2 21.55,13.3 v21.34,13.08
  Bottom 0.6: 30.61,32.13 32.08,32.13 32.15,32.06 34.1,32.06 v36.07,30.1
  Bottom 1: C4.2 v31.24,25.53 | U2.4 30.61,32.13
  other vias: 8.71,33.78 8.68,32.1 9.96,33.78 9.91,32.51 12.7,31.88 5.26,31.24 2.99,33.47 3.05,32.23 3.62,31.14 24.59,19.03 33.82,13.25 33.71,12.22 36.07,12.06 36.07,9.27 37.59,9.14 38.86,9.14 37.87,12.12 40.39,12.06 35.33,40.23 11.3,16.26 10.41,15.37 8.89,15.24 5.49,16.03 9.56,16.26 7.93,17.12 6.6,17.27 7.11,15.37 25.43,46.91 26.67,46.61 25.65,45.59 26.67,44.95 26.67,43.43 25.65,44.23 25.37,42.72 23.75,42.29 17.02,46.35 17.02,45.04 17.02,43.67 9.02,46.1 10.16,46.1 11.3,46.1 12.57,46.1 12.57,44.7 11.3,44.7 9.91,44.7 10.67,41.47 10.29,43.05 11.94,42.93 11.68,41.66 9.27,41.66 13.23,42.96 28.35,46.94 29.62,46.94 31.06,46.94 32.69,46.94 34.16,46.74 35.69,46.74 35.81,45.47 35.94,43.69 34.16,44.07 34.04,45.47 32.26,45.34 32.38,43.94 30.61,44.2 30.61,45.59 29.34,45.21 29.08,43.94 36.2,42.29 37.47,41.53 38.99,41.27 39.49,42.47 38.99,45.47 38.86,46.86 37.47,46.35 37.47,44.96 37.59,43.05 1.02,4.7 0.76,7.49 0.64,9.02 0.64,10.29 0.64,11.81 21.84,2.71 22.68,1.54 21.59,0.66 26.48,2.33 27.57,2.38 28.88,2.33 28.88,1.33 27.43,1.23 26.38,1.23 25.12,1.43 25.18,3.33 26.68,3.38 47.89,4.2 47.84,5.45 47.79,6.7 47.84,2.65 47.79,0.94 49.29,1.04 4.53,1.1 3.5,0.95 16.64,25.13 17.74,25.18 18.89,25.18 20.14,25.23 21.34,25.23 22.49,25.13 5.98,28.27 3.78,13.62 4.53,14.47 3.08,14.68 1.98,14.72 0.73,14.72 27.88,44.04 27.88,45.39 38.94,44.09 40.34,45.82 40.29,43.72 35.53,39.23 7.77,41.63 4.66,41.6 3.32,42.36 4.96,42.95 6.24,41.57 6.4,43.11 8.18,43.14 7.95,44.6 7.3,46.03 5.91,46.04 6.2,44.56
  pour Top: 5.46,31.62 5.46,34.42 5.71,34.67 9.14,34.67 9.53,34.29 10.54,34.29 11.05,33.78 11.94,33.78 12.7,34.54 16.13,34.54 16.13,33.15 14.35,31.37 8.76,31.37 8,30.61 5.71,30.61 5.71,31.37
  pour Top: 5.8,34.84 4.87,33.92 0.64,33.92 0.64,32.38 1.14,31.62 1.2,31.62 2.21,30.61 5.95,30.61
  pour Top: 5.46,30.86 5.46,29.46 5.97,28.96 6.93,28.96 6.93,30.86
  pour Bottom: 25.02,18.67 25.02,17.78 25.65,17.14 26.67,17.14 27.56,18.03 27.56,19.05 27.3,19.3 25.65,19.3
  pour Bottom: 28.83,14.48 32.13,14.48 32.89,13.72 32.89,12.45 32.64,12.19 30.73,12.19 29.59,13.34 28.83,13.34 28.57,13.59 28.57,14.35 28.7,14.35
  pour Bottom: 36.2,37.34 36.2,35.43 36.45,35.18 37.72,35.18 37.72,36.32 37.97,36.58 37.97,38.23 37.34,38.86 36.58,38.86 36.07,38.35 36.07,37.47
  pour Top: 34.92,11.56 35.94,12.57 40.51,12.57 40.89,12.19 40.89,11.43 41.53,10.79 39.24,8.51 36.07,8.51 34.92,9.65
  pour Top: 15.62,31.62 15.62,30.61 17.02,29.21 17.27,29.21 17.27,31.5 16.89,31.88 15.88,31.88
  pour Bottom: 36.32,37.85 34.54,39.62 33.78,39.62 33.66,39.75 31.11,39.75 30.48,40.39 30.48,41.27 30.86,41.66 34.16,41.66 34.8,41.02 35.43,41.02 37.21,39.24 37.21,38.73
  pour Bottom: 32,12.32 32.51,11.81 34.16,11.81 34.67,12.32 34.67,12.95 34.04,13.59 32.51,13.59 32,13.08
  pour Bottom: 22.48,34.92 22.73,35.18 24.51,35.18 24.51,34.54 24.26,34.29 24.13,34.29 23.88,34.04 22.48,34.04 21.46,33.02 21.46,32.26 22.35,31.37 24.38,31.37 24.64,31.11 24.64,30.73 24.38,30.48 18.67,30.48 17.78,29.59 16.51,29.59 15.88,30.23 15.88,30.86 16,30.99 16.89,30.99 17.27,30.61 17.91,30.61 19.81,32.51 19.81,34.42 20.32,34.92
  pour Bottom: 27.94,36.58 29.84,36.58 30.1,36.32 30.1,35.81 29.72,35.43 27.81,35.43 27.56,35.18 27.56,34.54 27.43,34.42 27.43,32.64 29.59,32.64 29.84,32.38 29.84,32 29.59,31.75 29.34,31.75 29.21,31.62 28.07,31.62 27.43,30.99 27.43,29.34 27.94,28.83 29.21,28.83 29.84,28.19 29.84,27.81 29.59,27.56 27.69,27.56 26.54,28.7 26.54,33.4 26.8,33.66 26.8,35.43
  pour Bottom: 24,31.24 22.99,31.24 22.73,30.99 22.73,30.61 22.86,30.48 26.54,30.48 27.18,31.11 27.18,32.13 26.8,32.51 25.78,32.51 24.77,31.5 24.26,31.5
  pour Bottom: 25.02,17.78 25.02,17.91 24.51,18.41 24.38,18.41 23.88,18.92 23.88,19.68 24.13,19.94 26.04,19.94 26.16,19.81 26.8,19.81 27.43,19.18 27.43,17.91 26.54,17.02 25.78,17.02
  pour Route2: 0.13,48.01 52.96,48.01 52.96,-0.13 0.13,-0.13
  pour Top: 19.3,41.66 19.3,40.39 19.43,40.26 20.19,40.26 20.32,40.26 20.45,40.39 20.45,41.66 20.45,41.91 20.32,42.04 20.07,42.29 20.07,42.93 19.81,43.18 19.81,46.61 19.81,47.24 19.68,47.37 19.56,47.5 18.54,47.5 17.27,47.5 17.02,47.24 16.51,46.74 16.51,44.2 16.51,43.31 16.76,43.05 17.02,42.8 17.4,42.8 17.65,42.55 18.41,42.55
  pour Top: 22.1,41.53 22.1,40.51 22.23,40.39 22.35,40.39 25.78,40.39 25.91,40.39 26.04,40.51 26.04,42.29 26.29,42.55 26.8,42.55 27.56,43.31 27.56,46.99 27.3,47.24 27.05,47.5 22.99,47.5 22.48,46.99 22.48,46.74 22.48,44.96 22.73,44.7 22.73,43.18 22.73,42.16 22.61,42.04
  pour Top: 4.57,19.18 9.91,19.18 11.4,17.68 11.81,17.12 11.81,16 10.54,14.73 5.84,14.73 4.19,16.38 4.19,18.8
  pour Top: 5.21,46.99 5.21,44.7 4.95,44.45 3.81,43.31 3.56,43.31 2.41,43.31 2.16,43.05 1.78,42.67 1.78,41.66 2.67,40.77 3.56,40.77 4.06,40.77 4.19,40.64 6.86,40.64 6.99,40.51 9.4,40.51 9.65,40.77 10.67,40.77 11.18,40.26 12.57,40.26 13.08,40.77 14.35,42.04 14.35,43.43 14.35,46.61 13.84,47.12 5.33,47.12
  pour Top: 28.07,47.5 28.07,47.37 27.81,47.12 27.69,47.12 27.43,46.86 27.3,46.74 27.3,43.56 28.07,42.8 28.19,42.8 29.59,42.8 29.97,43.18 30.61,43.18 30.86,43.43 31.75,43.43 32.26,42.93 32.64,42.93 32.77,43.05 32.89,43.05 33.27,43.43 33.78,43.43 34.42,43.43 34.8,43.05 35.43,42.42 35.43,41.78 36.32,40.89 36.96,40.89 37.21,40.64 39.62,40.64 41.02,42.04 41.02,43.43 41.02,46.35 40.13,47.24 39.75,47.62 39.62,47.62 28.19,47.62
  pour Top: 2.03,12.32 3.17,13.46 3.17,13.84 3.05,13.97 0.51,13.97 0.25,13.72 0.25,4.57 0.76,4.06 1.65,4.06 2.41,4.83 2.92,4.83 3.05,4.95 3.05,6.48 2.79,6.73 2.54,6.73 2.29,6.99 2.29,9.02 2.03,9.27
  pour Top: 18.29,2.92 18.67,3.3 20.07,3.3 21.59,3.3 22.35,2.54 23.24,1.65 23.24,1.14 22.48,0.38 21.08,0.38 20.32,0.38 20.07,0.64 18.03,0.64 17.78,0.89 17.78,2.16 17.78,2.41
  pour Top: 10.67,16.64 11.56,16.64 12.29,17.37 11.48,21.21 10.41,21.21 10.41,18.29 10.03,17.91 10.03,17.27
  pour Top: 10.67,16.13 11.3,15.49 11.81,15.49 12.19,15.11 13.34,15.11 13.34,16.13 12.7,16.76 11.05,16.76 10.67,16.38
  pour Top: 22.48,2.41 22.48,2.67 22.86,3.05 24,3.05 24.26,2.79 24.26,2.16 23.75,1.65 23.37,1.65 23.24,1.65
  pour Top: 11.56,46.74 12.57,46.74 13.21,47.37 17.53,47.37 17.53,44.96 17.4,44.83 17.27,44.7 16.89,44.7 16.26,45.34 15.75,45.85 14.86,45.85 13.97,45.85 13.34,45.21 12.7,45.21 12.06,44.58 11.81,44.58 10.92,45.47 10.92,46.1
  pour Top: 9.15,8 9.35,7.8 9.35,7.4 9.95,6.8 9.95,6.2 9.75,6 8.8,6 8.75,6.05 7.1,6.05 6.85,6.3 6.85,6.85 7.1,7.1 7.1,8.6 7.25,8.75 8.5,8.75 9.15,8.1
  pour Bottom: 22.79,47.1 22.79,41.48 23.01,41.26 24.12,40.15 26.09,40.15 27.29,41.35 27.29,42.37 28.36,43.44 28.5,43.44 28.5,44.53 29.47,44.53 29.49,44.51 29.91,44.51 30.17,44.77 31.05,44.77 31.4,45.12 31.67,45.39 31.67,46.13 31.9,46.36 31.9,47.43 31.7,47.63 24.27,47.63 23.31,47.63 22.79,47.11
  pour Bottom: 17.66,42.68 17.45,42.89 17.45,43.48 17.59,43.62 17.59,44.3 17.56,44.33 16.68,44.33 16.54,44.47 16.21,44.8 16.21,46.44 16.21,46.99 16.65,47.43 19.71,47.43 25.09,47.43 25.83,46.69 26.12,46.4 26.12,42.86 26.12,42.43 24.88,41.19 21.5,41.19 20.43,42.26 18.9,42.26 18.54,42.62 18.32,42.62 18.26,42.68 18.25,42.68
GSM_ANT
  Top 1: X1.P 21.21,41.06 U1.40
GSM_RX
  Top 0.15: U1.31 35.57,41.01 36.35,40.23 40.38,40.23 40.95,40.8 42.05,40.8 42.54,40.31 D4.2
GSM_TX  (via drill 0.35)
  Top 0.15: U1.32 32.46,41.99 33.15,42.67 v33.78,42.67 | v44.2,33.78 44.2,33.4 42.55,31.75 42.55,31.24 40.64,29.34 v37.34,29.34
  Bottom 0.15: v33.78,42.67 34.42,42.67 38.1,38.99 41.78,38.99 44.2,36.58 v44.2,33.78 | v37.34,29.34 35.18,29.34 33.66,30.86 U2.5
IO0  (via drill 0.3, 0.35)
  Top 0.15: v40.51,22.35 43.43,22.35 43.56,22.23 43.56,20.7 40.89,18.03 35.31,18.03 35.24,18.1 34.2,18.1 | v24.01,4.04 25.13,4.04 26.12,5.04 FLASH.1_1 FLASH.1_2 26.12,11.89 | 26.12,11.89 R10.1 | v34.04,9.65 29.97,9.65 v29.46,10.16 | v25.02,11.05 24.77,11.3 24.77,11.56 25.1,11.89 26.12,11.89 | v35.3,16 35.3,17 34.2,18.1 | 34.2,18.1 33.1,18.1 31.62,16.62 U4.18 | v36.83,28.07 37.73,28.07 38.3,27.5 38.3,26.74 v37.85,26.29
  Bottom 0.15: v34.04,9.65 35.31,10.92 v35.31,15.99 v35.3,16 | U2.6 33.4,29.59 34.92,28.07 v36.83,28.07 | v37.85,26.29 36.32,24.77 36.32,24.13 37.47,22.99 39.88,22.99 v40.51,22.35 | T2.C 23.79,4.26 v24.01,4.04 | v29.46,10.16 28.75,10.16 28.12,10.79 25.27,10.79 v25.02,11.05
IO2  (via drill 0.35)
  Top 0.15: U4.17 31.16,18.67 39.12,18.67 v41.78,21.34 | D4.1 42.54,36.81 42.85,36.5 43.35,36.5 43.45,36.6 43.45,37.8 v44.05,38.4
  Bottom 0.15: v41.78,21.34 41.78,23.62 44.32,26.16 44.32,32.91 44.9,33.49 44.9,36.6 44.05,37.45 v44.05,38.4
IO12  (via drill 0.3, 0.35)
  Top 0.15: v39.12,16.13 39.5,16.51 42.8,16.51 44.91,18.62 U4.6 | v29.46,12.7 29.46,13.59 29.59,13.72 32.82,13.72 34.09,14.99 v36.45,14.99
  Bottom 0.15: v39.12,16.13 37.97,14.99 v36.45,14.99 | R12.2 28.18,14.35 28.43,14.1 28.43,13.09 28.83,12.7 v29.46,12.7
IO13  (via drill 0.35)
  Top 0.15: v40.01,17.27 42.04,17.27 43.31,18.54 43.31,19.56 44.37,20.62 U4.7
  Bottom 0.15: v40.01,17.27 37.34,19.94 32.64,19.94 32.26,19.56 29.96,19.56 29.58,19.18 28.19,19.18 27.94,18.92 27.94,17.91 27.06,17.03 MK2.4
IO14  (via drill 0.35)
  Top 0.15: v28.7,18.16 28.7,17.53 27.56,16.38 27.18,16 26.29,16 26.16,16.13 25.65,16.13 v24.64,15.11 | U4.5 44.43,16.62 44.07,16.26 44.07,13.72 43.31,12.95 39.88,12.95 37.47,15.37 v37.47,16.76
  Bottom 0.1: MK2.1 25.26,15.74 v24.64,15.11
  Bottom 0.15: v28.7,18.16 29.21,18.67 35.94,18.67 37.47,17.14 v37.47,16.76
IO15  (via drill 0.3, 0.35)
  Top 0.15: U4.16 32.94,20.62 v34.5,22.18 | v48.39,19.68 R5.1
  Bottom 0.15: v34.5,22.18 34.58,22.1 39.12,22.1 44.07,17.14 46.48,17.14 47.62,18.29 47.62,19.3 48.01,19.68 v48.39,19.68
N$1
  pour Top: 16.45,17.75 16.45,18.05 14.3,18.05 14,18.35 14,18.5 13.8,18.7 13.8,20.75 13.9,20.85 13.9,21.6 15.05,22.75 15.05,23.75 14.8,24 13.65,24 13.15,23.5 13.15,21.9 12.9,21.65 12.9,21.6 12.4,21.1 12.4,19.25 12.45,19.2 12.45,18.95 12.75,18.65 12.75,17.55 12.95,17.35 13.95,17.35 14.35,17.75
N$2  (via drill 0.35)
  Top 0.15: U6.7 13.74,11.46 13.97,11.68 13.97,12.5 13.87,12.6 13.87,12.67 v13.21,13.34
  Bottom 0.15: v13.21,13.34 12.57,13.34 12.32,13.08 12.32,12.45 12.83,11.94 R2.2
N$3
  Bottom 0.15: MK2.2 25.24,16.64 24.77,16.64 23.93,15.8 23.93,14.75 R11.2
N$4  (via drill 0.3)
  Top 0.15: v16.51,15.49 16.51,15.75 16.79,16.03 U5.8
  Bottom 0.15: R15.1 18.25,14.35 R13.2 17.06,14.57 16.51,15.11 v16.51,15.49
N$5
  Top 0.15: U5.9 17.29,15.22 17.65,14.86 17.65,14.48 17.91,14.22 R16.1
N$6  (via drill 0.35 pad 0.6)
  Top 0.15: v13.34,30.35 12.83,30.35 12.57,30.1 12.57,29.97 12.7,29.84 12.95,29.84 13.21,29.59 CHRG.C
  Bottom 0.15: v13.34,30.35 13.45,30.35 14.15,29.65 14.15,27 14.73,26.42 R17.1
N$7  (via drill 0.3)
  Top 0.15: v21.94,22.23 21.5,21.79 21.5,21.3 22.25,20.55 23.1,20.55 23.61,20.04 TXT.C
  Bottom 0.15: R22.1 23.71,21.74 23.22,22.23 v21.94,22.23
N$8  (via drill 0.3)
  Top 0.15: RXT.C 24.13,18.29 24.26,18.16 v24.26,17.27
  Bottom 0.15: R18.1 24,16.64 24.26,16.89 v24.26,17.27
N$9  (via drill 0.35 pad 0.6)
  Top 0.15: IC2.1 9.72,28.13 v9.4,28.45
  Bottom 0.15: v9.4,28.45 9.02,28.45 8.86,28.29 8.86,26.91 9.32,26.45 10.3,26.45 10.5,26.25 R19.2 11.48,25.27 12.05,24.7 12.05,24.2 12.21,24.04 R17.2
N$10
  Top 0.15: NET.A 37.86,35.14 R6.2
N$11
  Top 0.15: PWR.A 39.21,37.1 R7.2
N$12  (via drill 0.35 pad 0.6)
  Top 0.15: v7.62,28.57 7.62,29.47 FULL.A
  Bottom 0.15: R19.1 8.51,25.57 8.51,27.69 v7.62,28.57
N$13  (via drill 0.35)
  Top 0.15: IC2.5 9.72,30.8 9.65,30.86 9.02,30.86 v8.76,30.61
  Bottom 0.15: v8.76,30.61 8.54,30.61 8.25,30.9 8.25,31.1 8.45,31.3 8.68,31.3 8.75,31.37 R20.1
N$14
  Top 0.15: R1.2 37.86,31.41 RI.A
N$15
  Bottom 0.15: T1.B 24.75,8.45 R3.2
N$16
  Bottom 0.15: R4.2 21.04,6.77 T2.B
N$17
  Top 0.15: U5.19 20.66,19.43 TXT.A
N$18
  Top 0.15: U5.18 21.34,18.92 21.59,18.67 21.59,18.54 21.84,18.29 RXT.A
N$20
  Top 0.15: C14.2 7.63,12.24 U6.1
N$21  (via drill 0.35)
  Top 0.15: U6.8 12.83,12.47 12.83,12.7 12.32,13.21 11.94,13.21 11.81,13.34 v11.3,13.34
  Bottom 0.15: v11.3,13.34 12.06,14.1 R21.1
N$22
  Bottom 0.15: R12.1 25.82,14.9 26.16,15.24 MK2.6
N$25  (via drill 0.3)
  Top 0.15: v4.95,2.41 4.95,3.05 5.69,3.79 USB.A
  Bottom 0.15: R14.1 5.67,1.31 5.42,1.31 4.95,1.78 v4.95,2.41
NETSTAT  (via drill 0.35)
  Top 0.1: v35.56,33.4 35.11,33.4 34.92,33.21 33.22,33.21 U1.64
  Bottom 0.15: v35.56,33.4 34.29,33.4 33.02,34.67 U2.2
NETSTAT_5V  (via drill 0.35)
  Top 0.15: R6.1 40.84,35.43 v41.49,34.77
  Bottom 0.15: U2.3 31.62,33.4 32.38,32.64 35.94,32.64 36.96,33.66 36.96,33.78 37.95,34.77 v41.49,34.77
PWRKEY  (via drill 0.35)
  Top 0.1: U1.48 19.42,32.51 18.72,33.21 17.33,33.21 v16.76,32.64
  Bottom 0.1: v16.76,32.64 16.51,32.38 16.26,32.38 16,32.64 16,36.45 14.99,37.47 D1.2
PWRSTAT  (via drill 0.35)
  Top 0.15: U1.4 17.14,35.31 17.02,35.43 17.02,36.96 v16.51,37.47
  Bottom 0.15: v16.51,37.47 16.51,37.97 16.76,38.23 17.53,38.23 18.8,36.96 18.8,32.89 17.27,31.37 15.75,31.37 15.62,31.24 15.62,29.34 14.73,28.45 14.73,28.07 14.99,27.81 17.78,27.81 19.56,29.59 U2.9
PWRSTAT_5V  (via drill 0.35)
  Top 0.15: v42.42,32.77 42.57,32.77 43.45,33.65 43.45,35.15 42.75,35.85 41.3,35.85 40.75,36.4 40.75,39.51 40.39,39.88 38.48,39.88 37.51,38.91 R7.1
  Bottom 0.15: U2.8 25.78,28.32 27.05,27.05 38.73,27.05 42.25,30.57 42.25,32.6 v42.42,32.77
RI  (via drill 0.35)
  Top 0.1: U1.68 31.76,40.27 31.76,41.66 31.24,42.18 v31.24,42.55
  Bottom 0.15: v31.24,42.55 30.48,43.31 29.97,43.31 28.45,41.78 28.45,40.01 25.4,36.96 25.4,33.91 24.89,33.4 U2.12
RI_5V  (via drill 0.35)
  Top 0.15: v35.81,34.67 36.58,33.91 v36.58,32.26 | v41.53,31.5 41.53,32.13 40.51,33.15 40.13,33.15 40.01,33.02 40.01,32.89 39.75,32.64 RI.C
  Bottom 0.15: U2.11 24.26,32.13 26.42,34.29 26.42,36.96 28.57,39.12 34.16,39.12 35.69,37.59 35.69,34.8 v35.81,34.67 | v36.58,32.26 37.08,31.75 41.27,31.75 v41.53,31.5
RTS  (via drill 0.35)
  Top 0.15: v20.4,10.85 21.4,10.85 22.9,12.35 22.9,14.66 23.44,15.2 23.44,15.79 23.44,16.04 23.95,16.55 24.5,16.55 25,17.05 25,18.44 25.3,18.73 25.3,19.32 24.88,19.73 24.57,19.73 23.96,20.34 23.96,20.6 22.95,21.61 22.95,22.2 21.99,23.16 20.67,23.16 20.56,23.05 19.15,23.05 18.79,22.69 U5.24
  Bottom 0.15: T1.E 21.13,8.47 R4.1 19.18,10.38 19.65,10.85 v20.4,10.85
SIMCLK  (via drill 0.35)
  Top 0.1: U1.55 24.76,27.71 24.76,26.16 24.64,26.03 24.13,25.52 v24.13,25.27
  Top 0.15: v27.43,20.95 27.32,21.07 D3.3
  Bottom 0.15: X2.C3 42.06,17.38 38.48,20.95 v27.43,20.95 27.05,20.57 25.27,20.57 25.15,20.7 25.15,21.72 24.13,22.73 v24.13,25.27
SIMDATA  (via drill 0.35)
  Top 0.15: U1.14 24.06,26.6 23.37,25.91 23.37,24.9 25.53,22.74 25.53,21.23 26.5,20.25 27.73,20.25 28.19,20.72 28.19,22.48 | D3.4 27.32,23.35 28.19,22.48 | v43.31,30.61 43.31,29.34 39.24,25.27 32.77,25.27 31.75,24.26 30.61,24.26 29.08,22.73 28.45,22.73 28.19,22.48
  Bottom 0.15: v43.31,30.61 43.31,33.26 43.45,33.4 43.45,34.15 42.06,35.54 X2.C7
SIMRST  (via drill 0.35)
  Top 0.1: D3.5 26.67,24.64 26.88,24.84 27.46,24.84 27.51,24.89 28.19,24.89 28.57,24.51 v28.57,23.62
  Top 0.15: U1.15 25.46,25.84 v25.27,25.65 | v42.93,14.48 42.55,14.1 v40.64,14.1
  Bottom 0.15: v25.27,25.65 27.3,23.62 v28.57,23.62 30.73,21.46 38.73,21.46 42.93,17.27 v42.93,14.48 | v40.64,14.1 39.52,12.98 X2.C2
V_IN  (via drill 0.35)
  other vias: 3.94,5.71 4.45,4.83 3.3,10.79 4.32,10.79
  pour Top: 13.84,3.43 13.97,3.43 14.1,3.56 14.1,4.95 13.97,5.08 13.46,5.59 12.7,5.59 9.78,5.59 4.83,5.59 4.45,5.97 3.94,6.48 3.56,6.48 3.43,6.35 3.43,5.21 3.43,4.83 4.19,4.06 4.32,3.94 5.08,3.94 5.71,4.57 5.71,5.08 5.84,5.21 6.35,5.21 7.11,5.21 7.62,4.7 10.16,4.7 10.41,4.95 10.67,4.95 10.79,5.08 13.21,5.08 13.46,4.83 13.46,3.68 13.46,3.56 13.59,3.43
  pour Bottom: 3.3,6.35 3.43,6.22 3.43,5.08 4.45,4.06 4.57,4.06 4.95,4.06 5.46,4.57 5.46,5.84 5.33,5.97 4.57,6.73 4.32,6.73 4.19,6.86 4.19,9.65 4.32,9.78 4.83,10.29 4.83,11.05 4.45,11.43 4.19,11.43 2.92,11.43 2.79,11.3 2.79,10.41 2.79,9.4 3.17,9.02 3.17,6.48
  pour Top: 2.54,11.81 2.54,10.67 2.92,10.29 3.05,10.16 4.32,10.16 4.7,10.16 4.95,10.41 4.95,11.3 4.95,11.94 4.57,12.32 4.32,12.57 3.17,12.57 2.92,12.57 2.79,12.45 2.67,12.45 2.54,12.32
  pour Top: 13.08,5.08 13.21,5.08 13.34,4.95 13.46,4.83 13.46,3.81 13.46,3.56 13.59,3.43 13.72,3.43 14.1,3.43 14.1,4.83 14.1,5.71 13.97,5.84 13.84,5.97 13.21,5.97 12.83,5.97 12.57,5.71 12.57,5.33 12.83,5.33
  pour Top: 4.6,5.7 4.6,6.4 5.1,6.9 5.35,6.9 6.15,6.9 6.25,6.8 6.4,6.65 6.4,6.4 6.4,5.65 6.35,5.6 6.05,5.3 5.6,5.3 5.25,4.95 5.25,4.75 4.85,4.35 4.45,4.35 4.1,4.35 3.55,4.9 3.5,4.95 3.5,5.8 3.5,6.05 3.65,6.2 4.3,6.2 4.35,6.15 4.4,6.1 4.4,5.75 4.45,5.7
V_LIPO  (via drill 0.35)
  other vias: 3.59,39.24 5,39.17 4.01,37.8 3.23,36.25 14.73,30.35 1.42,26.66 2.79,26.66 4.34,26.76 1.52,25.15 2.89,25.15 4.14,24.85 2.61,37.4
  pour Top: 0.71,35.69 9.4,35.69 9.65,35.43 11.94,35.43 12.45,34.92 16.26,34.92 16.51,35.18 16.51,36.2 15.49,37.21 13.97,37.21 12.45,38.73 11.43,38.73 10.41,39.75 9.91,39.75 9.53,40.13 2.26,40.13
  pour Bottom: 1.78,39.12 2.67,40.01 7.11,40.01 8.13,38.99 8.13,35.94 6.6,34.42
  pour Top: 15.24,31.72 15.24,29.97 16.64,28.57 16.64,26.8 14.48,24.64 12.06,24.64 11.68,25.02 11.68,25.78 11.3,26.16 11.3,27.81 11.94,27.81 11.94,27.18 13.35,25.76 15.11,26.3 15.11,28.83 14.1,29.84 14.1,30.35
  pour Bottom: 13.97,31.37 13.97,30.35 14.61,29.72 15.24,29.72 15.24,32.64 8.51,39.37 6.99,39.37 6.99,35.18 7.75,34.42 10.92,34.42
  pour Bottom: 0.64,27.18 0.64,24.51 1.27,23.88 5.46,23.88 6.35,24.77 6.35,26.54 4.19,28.7 3.43,28.7 2.16,29.97 2.16,30.86 2.03,30.99 2.03,33.91 3.3,35.18 4.83,35.18 5.33,35.69 6.22,35.69 7.24,36.7 7.24,39.37 6.35,40.26 1.78,40.26 0.89,39.37 0.89,27.43
  pour Top: 4.7,19.94 9.78,19.94 9.91,20.07 9.91,20.7 9.86,21.03 9.97,21.15 8.76,22.35 7.49,22.35 6.73,23.11 6.73,26.29 5.46,27.56 1.02,27.56 0.51,27.05 0.51,24.89 1.14,24.26 3.68,24.26 4.45,23.5 4.45,20.32 4.7,20.07
  pour Top: 15.9,37.9 15.9,37.4 15.5,37 15.4,36.9 13.6,36.9 13.3,37.2 13.3,38.2 14.7,39.6 15,39.6 15.2,39.8 16.5,39.8 16.7,40 16.7,40.9 17.5,41.7 17.8,41.7 18.8,41.7 18.9,41.6 18.9,39.4 18.5,39 16.7,39 16.3,38.6 15.9,38.2
VRTC  (via drill 0.35 pad 0.6)
  Top 0.1: U1.56 26.86,28.16 27.56,27.46 27.56,26.16 27.18,25.77 v27.18,25.53
  Bottom 0.15: v27.18,25.53 C4.1

### Text on the board
tPlace: /Users/mcleans/Desktop/Logo-Files-01.bmp | /Users/mcleans/Desktop/Logo-Files-01.bmp